# Altium project PAY_IF.PrjPcb (part 3 of 7)
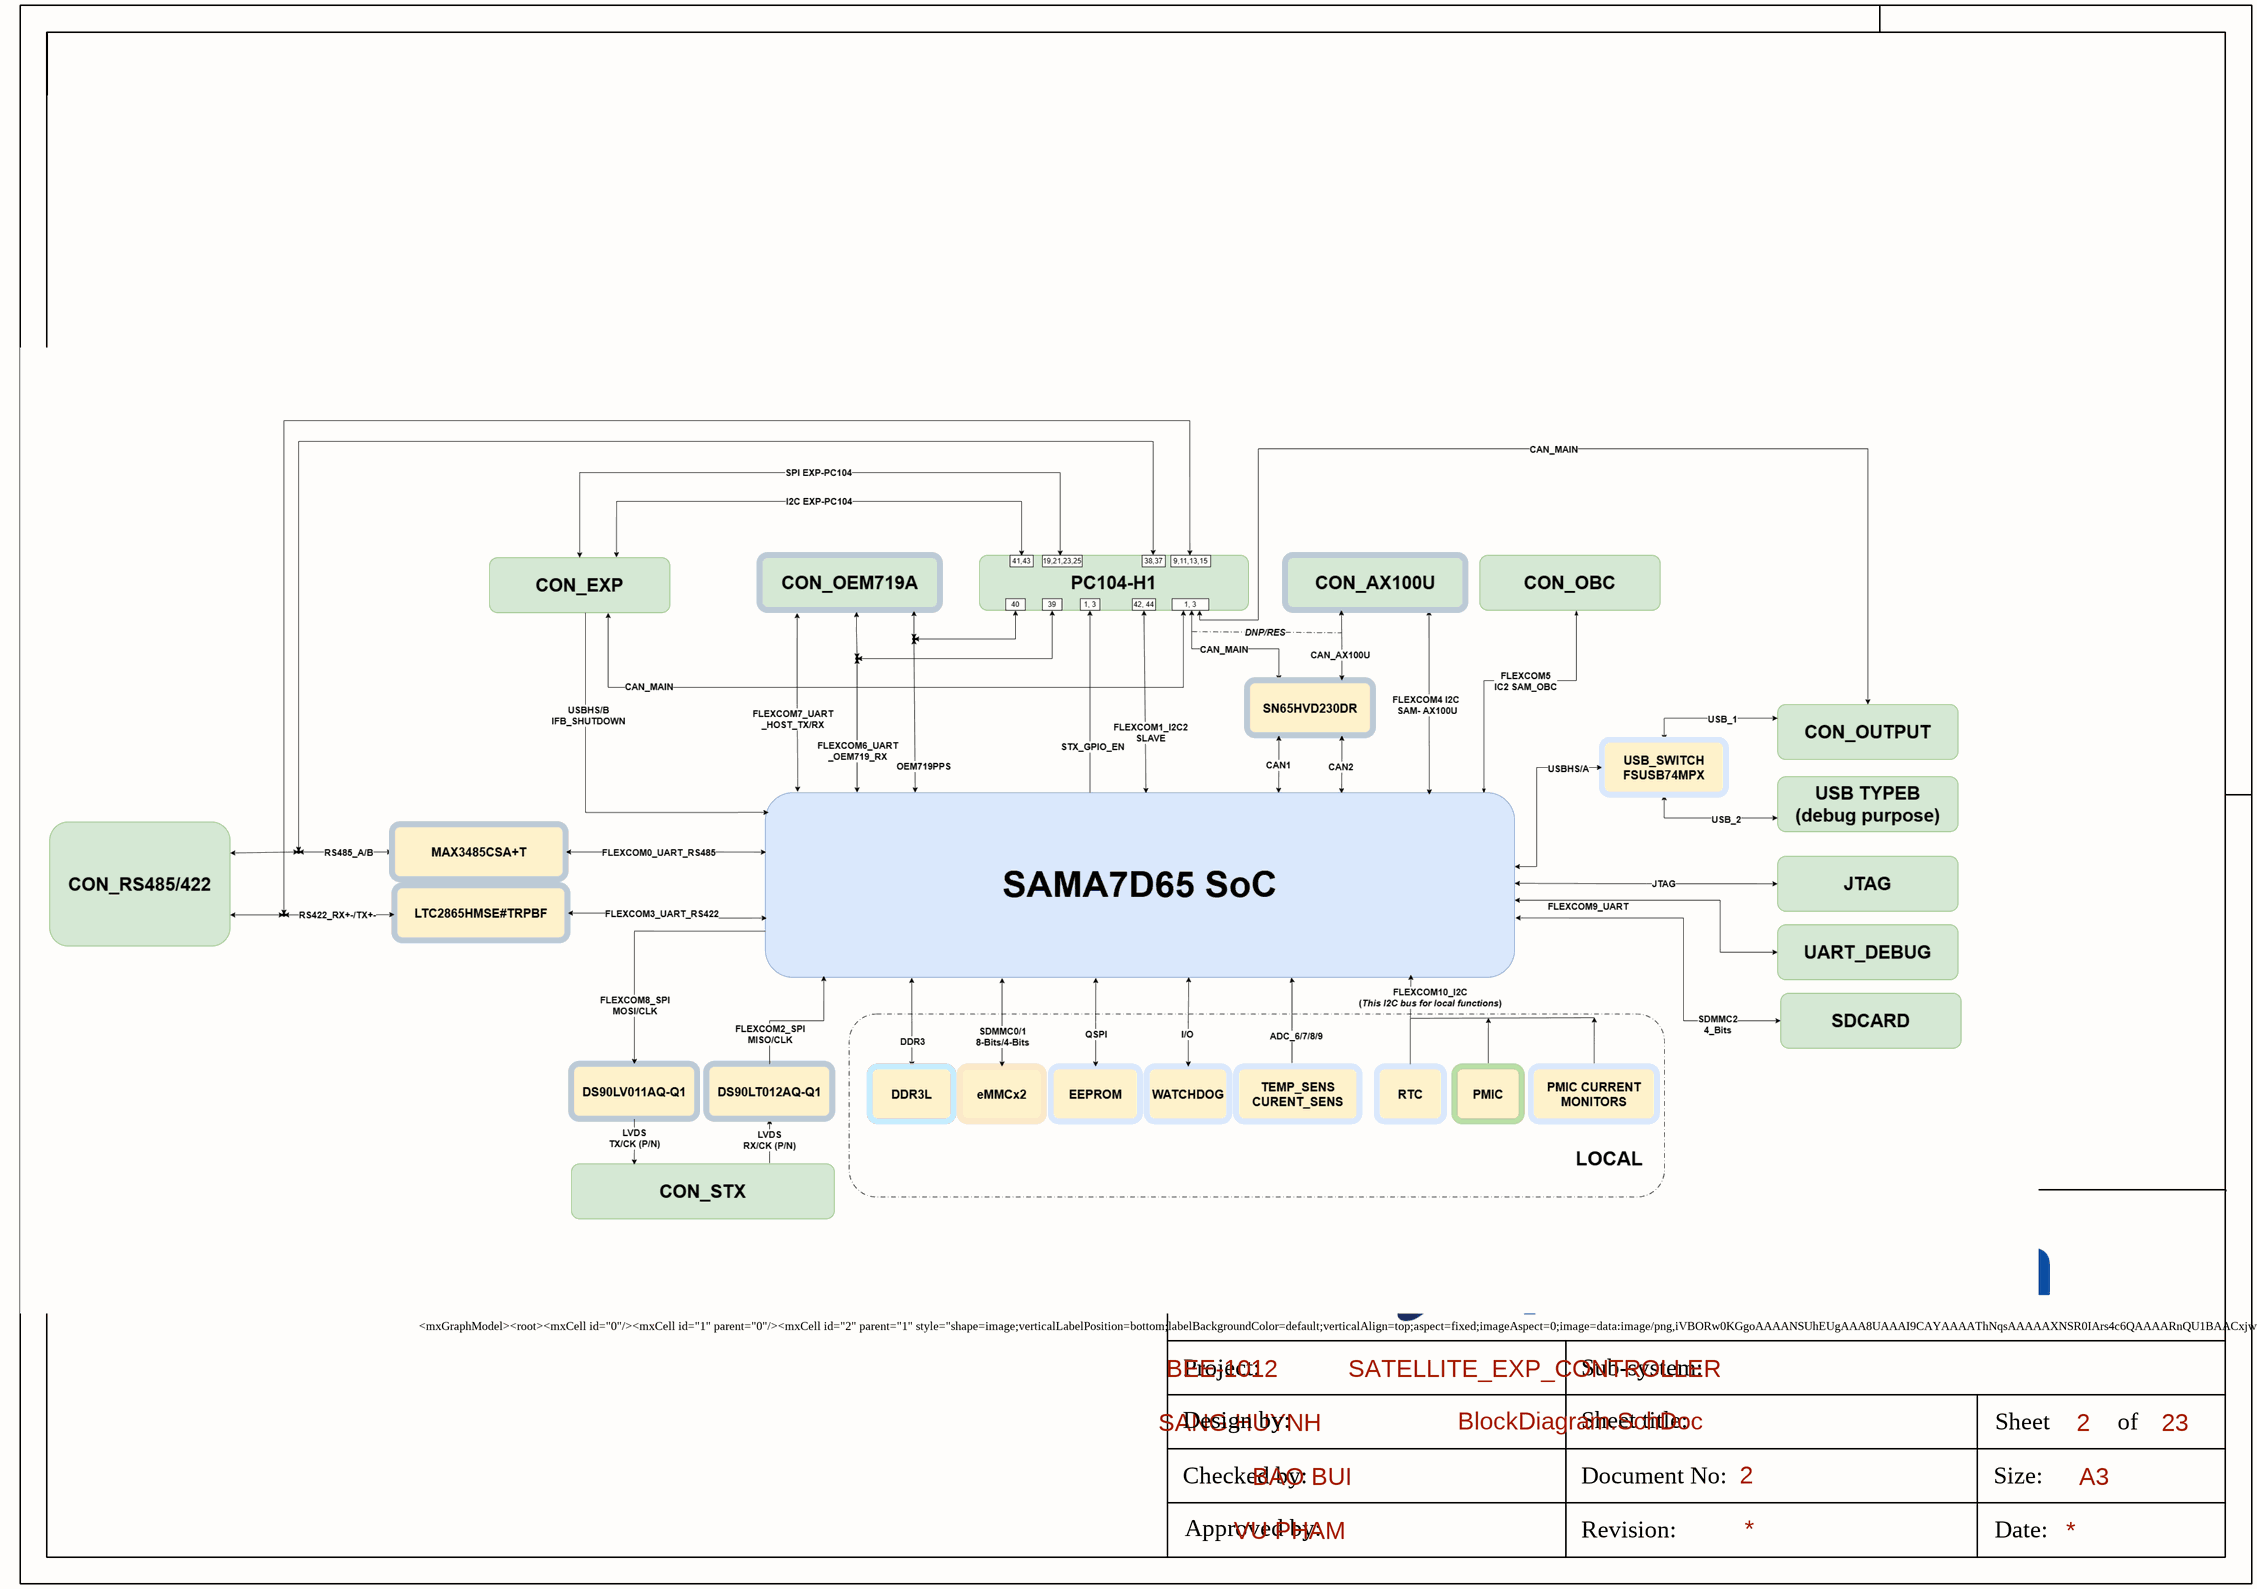
[diagram p29: BlockDiagram.SchDoc]

## Sheet BlockDiagram.SchDoc (continued)

### Notes on the sheet (continued)
JqvcTMV7Viu/XVq8e4P+ysQOpsY+cgftl/CTTGbK1QFBlSKSDqOwohJNKsQKHWWHbZzwsWz9ZQRYEslc7zK4TY5hW1xpJVG/St9bheu8T31fUY6Pg5Rfu2CP3aGnDN+aqy3LYfB0Pe8wbq2GzIe2Ubc1++foxoIiK6HAM1nyaiJixDdA2Yz69L36bTRERE5+Z7VrmQmmIiIiL6HnK8nnhEAiIionNiUExEREThOo9NTEREdNkYFBMREVGwamzirxlSioiIaGgMiomIiChQic+P3T87dWxGRER0udjRFtGJsQzRNWA+JyIiokvme1ZhTTERERERERFdLQbFREREREREdLUYFBMREREREdHVYlBMREREREREV2v0798/99fGO//995/9JyIiIiIiIqJv5d+/f/afAPY+TXR6LEN0DZjPiYiI6JL5nlXYfJqIiIiIiIiuFoNiIiIiIiIiuloMiomIiIiIiOhqMSgmIiIiIiKiq8WgmIiIiIiIiK4Wg2IiIiIiIiK6WgyKiYiIiIiI6GoxKCYiIiIiIqKrxaCYiIiIiIiIrhaDYiIiIiIiIrpaDIqJiIiIiIjoajEoJiIiIiIioqs1UFBcYhGNMBqFTdGitJbPkex/jxawf/Xrtu7RKEHesGx9u1y0bTXSalDmWCQRImsboyhCsshRhqxyr8yxSJJaWqNRhChKtunZyzjVj1mUtO5Jo3wRmdvT+RzaSpT5AklkpxshSjoes++iPLIM5El1DoPyL+rnPwrIxwf1vGNPh7xtL7qTJ/VlOk098ip9tfb8sy3nCRZ52ZiH6gLSNSZXnm9PI/i6fdbyDJT5wnmfOe5YBvoO97YoQdBh1M9X6/WlRL6ob+vX7veR+Q2oH7PWyVV2iIh+ANUiYBalVKYkoBA4ibRoXl6kyv7Vr9u6AaGM1WdS+02qTPvJJZO+/dAUmZLCXrd7ErJlnzuktU0v86fXcMxk2867FKkStbTaj2MjZ3r2JI7b1i+CkDKk73eXMqDlX29+1DmOcfjxdOcd9ySUdGyTXoaOmrocHzobhOTzTvkHuzzUdj1TR6Vbz5pd0hBKZrUEKmcqz0Uma2W5eXKXx8463I8u4t4Wcvz18+W5GIYeb08SW6fc75D9NTiOmXdylR0iou8BnmeVkdrO0Gg0GqFllt1byilWAAABKW/tGQz3T0vEY/0v2vIiRbGewfjZS19WIn2+x409i2GC2Fh5iUU0wXyz+6/MoJax9rumXCCazLGdVSJTSzjnNObbExDyFtsj84GP1cb4XaQF1jPHXucJounKkxbw8bHCxpyh5Tjq50vjXcYtT0aYbg8+hNjstsNzbHys4yZkiuenO0wAAAX+vL5gvjr8irRYw3XILk1QGdL3vct5yBOMtiegOQ9ZykWEySHD7wSv01/ePt/f8bYy86vMFPQiVeYJXt+1GQ70cmHmccP9E5bmBYQuQFA+b8k/+HzH+98PrA7lfKc1f7akW2PfB9CaxufnO97m/rx9cPLybN239oSAvK1KzcfHBzbWzcGfbotvem9rPE97+n41PQNo5wbY5ZGHe9zc7PLt2wr7bNu4zzjDfnvnc/Hn+zpX2SEi+h68zyp2lGwLmKXnW0rVc/k+y+4YNWdNb0ELlWpvdpvfBFtvXYVUaeFMUKkiU6kU2/lcCdo1ekKq5sqJQmX7tPaTK02lrGMmtTfWTfveREtHptrxOaam2Dy+TbUkhV6zf+z5PjOElKEz1SwZx/mocx9S3gqrNjg0P+hlJ3QZuhRB+Two/6htHkqtWjnv/KHp+oSkYeXtpvlOWp7NayUCahKLLD2U9eZ023y3e5vQ1tFyPWmtKQ67P21rgIXn93Psd4f8plTPZYmIvhd4nlUG+qb4mxvP8Cz3/9lg/uj4Jid/rd7KixRPjhfJAJAn2ltqkaJYLzEbN7xVHceYLdcoshTpvZ1gicWj9kZ+l1bzC9ox4uUaRSqqP61eAr6n+oWnw85v8PandYGDcvFyaB2QPt3ZP3djHd/fDW/Zx/ETDru4eUOHzSWYx1k8POHp4XAwO517vzHiZYZDkcIHPodKmq7EGPFsiXWR4nBF28zx2H5BO7Ex4id9m/6iMGc4uTzRa4gF0kJhvYy9NYPjeIblWqHIUjzc+eZs9u3ubbfP2n19hZfWBTzKP3gLuD9hHGO5XjfUEp9pv4mI6CgMineMh/jNHK9GTxI5kkOzKYH0d0PTpHKBl+qpoXk+yzieYWY/N+hBIiSywOZQ49nvKmjEBnNzR9zi+8O+b+avgZ1olPizf0oQDzjyOeug/Pw4/Fs83Hn2dYy7kwRy1yF/r/Lxw90Y47uHwwP+5u1P/WXQ0Sb4peXDv+eOHOhnGM/wWwsKwq9PJzS+0Zr1n/mFj3GPAWTW7ROScTzrNP/BN7236S8wNvPHrw0oz7jfRETUHYPigxjLrKrbWk2rHharGlEA8rnxoSJ/1d4Ce+YLUQUvgEifOnyfO8asej0OrN4DHiJjPB3uuiu8ty9g3ODlc9jN3af4W31AdXvjT80I5BhtdZDjkK32+XN8h+odw5A172PcOD8IJupmPHvWWh0EXp/O5hYtl6tBmfeYzP+d7IC+7b3NbgU2REB5ZOuAs+43ERF1xqBYpzfN3Te3Khd4rHrhQtb4FKIFHABkrclYF3pa2xq9TrSa39CaDD3QXL04mo8bSiwO1QYSvXZ1Z1JVK+IjZIP3Pj5btpUO8vfDy50qf+oPXAM9NAK1PPxr21sa0RH0l3bA6quj4vITh3Yt4teuI8BzMMtU2vQNz+C+973NaAV2bPNjo3XACtMkdKikvfPvNxERdcOg2DDG7LfZ3CrSvgGSmadHZf1BqW+gaKR1TE3EEU1Xu9QYat9XdXvjHaa19ld/QDnyrf01qmoqrPypP3ANVAthtK4YoHk9Xbex3uzgi1+E6bWmQ7SSCdb7vnCk735vM16qNPQZ0sp8MYPVFJNoO/5zkC/ZbyIi6uIEQfFf/Mlz5I1T4E3kKC3rDlm11dzqMCyCp3MtAEDx1xpiYSBH1USYTVfDal7Dawyrh8Ij3ng30GuqW9/mGw8YFET/JlDeWy8yYtxXUXG/5qlliTzRh3wK//6QqNHkV3V9aDXAfQBAUZYo9SlfIIn2Q9AB4ozNlwHrHnPUfeFI3/7eZjXBr/UZEmY8WyOTWi7crDCfTjDqEhzjvPvd3TBlh4joW7K7o7YFzFIfqsE7uYZ+6TMkQId1B6dtp+naZsuQQwUNkJY+bEh9eIim4x0yJE7TsvqQFU3L+pnD+Agl00xlRaGKolBFkaksrYYVqabj1nVOCClDJx3CRakirYb2cI7qoec55wx7dtnwTEK2lxtDSP6jS4WQfN54/WhhDGXjyhtd8mXTesPTaBsC6RTlWS/DzWW0fR8aF20ywP3oYIC0gu9t9o761t06JFOlyKyhwg6TULJpfCXfugMF73fn9NvzTN9tJyK6FPA8q5ygprjNMU2HzqxWE3ktvRy31xjqzWKHbjoYLwujl83VfIrpZILJZILJZIrpfI7VSaosfjqtp/Cm5o8DN6EWaQa1XvbqkIfoUm1WU0xGERJvk5YvULt31Z2ulvHCGcP5HT+81zheYq0KZKm0Wi9ssJpOMIqOaZ5NRERfbfigWKQolIJqnDzf5fbVtu6gIRCssQR3LmIokCO19eas04ewqHe4FRBc9TLGbDeWphR2Y0kBISTSrIBSWscpRzVFuzL6GJu1ptN75guRoDE9hUSaZciyDFmWQmpNCzfzKaKQNIi6aivzQ9wHGtIoikJrQrvBaj45Wz43vqtuMp7h96FMVlOqN/v9Qbrc2+xenPvd03fjaKv9/Ur7aTPH5MSBcbf97qAh33cqO0RE39TwQfE3Vy4eq7EEZYZMG6pomnhuofo3b307f+qdVglt2N9ufB1uacMwnaKDrb1xPMNyvbZuyGus10vM4rFZG3J7w5t0i/LPW9Ux0P3E/E5SmyZVVBw4ZvEv3MUx4jhGHM+wXK6hCr2jugl8RYYomP5d6xeW+fF4jHi5htKG7+sXXB3J05pjfCiT1XT3y56rg973I03vtHrc2wAgXqI6dYEv/1ps71eF9qywDYyN75a/er+JiKgVg2JDjldr+KVY76BjNW1+yDeGbOg5ZELvtApUw/52rdEd466Kio0Ot6rei4frYOso2gOy+Clj/RjnfEh6ngZW031zdMe070EIjhciocYzrPXxvmutDYi6M8Z4vYQybw3fV/vU5BTl+auG5el9P9L0TqvPvW1Lbw21mT/6O3UMNkY8W2sBtzV02AXsNxER+TEo1uTJ9PC9bFUTao2R2fiQbw6Z0O8b5J5paePRtjY1dDB66tzXSBi9Fz9/6bei+gPyyZqRfaUONQllW/WBnhc6OSLf7Vnf7h3T0ytRxRwn9zLKfIfegAcrz/onDv4RAobV835k6JlWz3sbsH1xp48wMeRxjLXWNubQYRew30RE5MWgeC9PDkNtABLPWtQ3nv0O6KBDr2Ht26TOSiuoKeteicUhegXEw90RTQ3r35eaTXC/8DW1Hpz/qDfm+kOTo+bJSf/G2117r79AkJnjGzF70ps/d8p3OjP/GjUmRB2ZY163DI13MU5Tno2gy9dyaVA/6d62FS+1filWL1iEvrU42mXsNxERNWNQDNRuOjKzOwML66DDqGHFCtPQzjbKvDbOoT2uojsQr8uTSfVNtBXcd2E0MXt7xGP1MfGXPpRWYySf9rvm87MCyWnizGMG7RtviAfUn6H1GrbAFwjGN+XH1/KarQ1axp0malDmiTbm9fA93h/P/MazXnt9ivJsN9sGVtPoLGXrJ93btvQWYBvMX96s349jNPO3gtfL2G8iImrCoBhW51pNQZ/VQYe7060YS/2jos0ckyhpHvC+zLFIIowmU8zf7VfVZrPtzXyCKFn404pGWm23K7jvwAiONlUg+mVvqUtz/0SK3z/s4aD+4Nmcd8pFhJF2sp3BgtbkLvwFwlC1vGZTz87NBenKlciTyPzOXWZYhmXiEyuRJ9o9o+GF0+DlGdi+oF1rtZzYYD6JkCxyT5Baovhr/62rH3Rv2zFbgFX3OJc8GWEUJcjLpo3cnsNqG101/Zex30RE5DZSSin7j7rRaISWWQDkSEa773FFiqJzt/3a8hCQ0t9Fyf3TEvFhBfq6JdLne9wYc9dN4ljbPnPdabFu/l62XCCa7Gsqm+ctF5FRu7ElIOTtrrOND3ysrJuwzKAcT3x5EmFqD84rBOSt1m3Hxwobe5a0wNq1cUDw+arvh0TWOKRWiUW0f6Ptm69JtU1CSjz8usfNDQB84v39DSvjGDQf+0sUVoZ28sR4OAas8/3xgZV1soXMsK7lHf18dDxeRj63z2VY3gHa0nHRy2LI/HRJwvJ527XecW3E9vpYLPXrtq3vfQBBaXx+vuNtvjK2T2aqOVgfrDxbjLKlMe4NH/j42HS8N/jV7wnAxd7bGtZrcJ2f2nL6tXRLCIFb7Tib9yf/Np58v53lyjTsMxQR0ffhfVZRLQJmUUplSgIKgIJIVWH/3EpbPmCS2fHLAkKl2gZmUvvNTNjJmN+zr0Umlait2z0J2ZyOUkoVaXhaEFKlmS811eF8WcfWe3wKlYr9vFL55nQLPI9CqtbduzAIKkOaIlXycCx9k1BSz8y6Iq3yjPccu+jn0lPeWtP1peOi54Fj8hB9pbB8HljOD5NQMqjAd0+3XnS6pxG0bUOUZ6dCZVI40mme2u41Ib7Nva39glO7RjUtl6WhxznsHJ50vwOmxmt60OQqO0RE3wM8zyrNv+z4Fq50eVB2cdyYPJN5Qe+2rHFBNwKH0IfwTHvAabs5FKrIUiWFqN0AhZBKppkqvMvrmtOCEErINODGuWc+OPiWqh662vf1cB5EGngsLUWmUimVsM/nbv+y8IN1URBUhmzN51sIsc079iK6TFbz+0+cU6E/BBoFrmNZ17bD9bBpynq+WKGvFJbP26/XovP1TAWla06u61lIGkKJXZBSW9yrZ3n2KlSWutPeXjuP2d42vv25nHtbGP2e7rleFoXKUunczuPO4ZD7HZJ3q2mwZygiom8GnmeVgZpPE1ETliG6BsznREREdMl8zyrsaIuIiIiIiIiuFoNiIiIiIiIiuloMiomIiIiIiOhqMSgmIiIiIiKiq8WgmIiIiIiIiK4Wg2IiIiIiIiK6WgyKiYiIiIiI6GoxKCYiIiIiIqKrxaCYiIiIiIiIrtbo379/yv6j7r///rP/RERERERERPSt/Pv3z/4TAGCklPIGxaPRCC2zEJEHyxBdA+ZzIiIiumS+ZxU2nyYiIiIiIqKrxaCYiIiIiIiIrhaDYiIiIiIiIrpaDIqJiIiIiIjoajEoJiIiIiIioqvFoJiIiIiIiIiuFoNiIiIiIiIiuloMiomIiIiIiOhqMSgmIiIiIiKiq8WgmIiI6MTKRYTRaITRKMKitH+lofA4ExHRMRgUExERnVSJP2+b3b9vcTO2fqaB8DgTEdFxGBQTERGdUvkHh1hN3iO2fqaB8DgTEf3/9u5fyU2dDQP448v4Tu3dIpMrkK/AmyZV2u2gtJt0KdOlwaXdpd1qmwNXYF/BToqFOucy9BX+gwSSECAwXj+/GWaStZHFiyRLWAjqKNCguMBmMTtNWWreFrU5TRni8+uLDaqvurX77NksRmbZt54vEyWvWloWRYZNvMCiksfFYoF4k6Hw+cizIsMmjmtpzWYLLBbxMb3qPkb1mC3ixiOxyi7T1U5b63PoUmAT95gOd46/IV6brG1iQ2pRByzlYLFYIM4K9742IcspkVW97alulzJX3fUki+v7tNqa2roB6kLx7wvKsVp1qNYUk7K9cn90PZ1x2vUWbZeKcQZuNM69dM1P0fH4s7j8DGMHon4+q1tTmxRWPT/jlC8DS1+jd59zEfv15dRzbo2BvVwM+l0xVGwMW/vyVyDb1PPWWMcIkA083iKlTGUESHhuIsnt+4tEVl91a/fZgJDax6eR8lokU+UlkzRyHYciT2Ukqp9t3kTUcMwt0jqml7rTs8Qsajp4kzyRopZWcxx95GlUSbty7pxymUaidoy1rXV5aw9t65AtT77lQEQyNSZg4JumTzmlu4a25bxxEzIyVHi1De609a1fretCU91uFxNDSE7M6QzfrjcdXwXjXLrJOHfUNz9qrHyO/0zp45n7bObzad7MbVJY5vwMX74ULc4VuvY5fc6hmn9rAOz1YpDvijFiY92ay1+932zerOG8A3D0VWby+Aar2WyGhrecrtQ8YQcAEIiiz9U3aL5+32Kp3euj7C8S5PsV/G8FUveNkPz4isfqWzQPWGofXmCzeMD6cnk5hdxWrzCfFBssHtanK9ERUrk1T8/S3ncmIKLPOEbmDW+7g/a6SHLsV4ajzmIsnnaOtIC3tx0O+hsa4qieL4VzH7MsnuHpGHwIcTjlwxEbLwWy+BlPu9pBIcn3MIWpqswXTvH6hh9fHwG84/31BWs1bdc5D6B1HbKcB/2YACEifP4MY3mypaEJWU7p7rUv5/X2+v31FS87vb2LUgm1ehZZjF+vyhsu1PKqt5Gar9+x1b+Ahq0LWYzZqeKa93HF5NhevWifbWsHr9WuN7ddF4yz5ibj3EWI/KhpNB2/qle58GuTwrpW+ToZsc/ZGEf1nFv7afZ6Efy7YujY9C1/SlkHTul9+4rHRwDvr3h92eHc9TXXhfvg7KtUR8lVHm9xXqnx02f/PvueaFfTbFeIc5koV4fsV1kqV31EJJPcmKCUeSqT86+ZpgSrV/mcvwAafhk1pSllJWaRctXLduw2SjpRosTH40qkTZ7oV+FEIpPL1T7P/FV//TftU4mtNVQBIFAdSiNxKgOmV+vn331MAcspUcByfizLStn0bk/UMu27jxy8LpTHYmu//GKifv+Y33etdt0n/5JxrrnNOLcXKD9j/FJsTbdrm9TFtcpXvV80TJ9TKJ/hyIus5Mcrbdv5q1LLZEMezkaJjS3/PuVPb7vMZf1YxyIh7K/fATj6KvZXTlw7l3xOqkuf/fvsW9IKnCkddaBlev2kMR2DPE1kUivhPl/OdXmiVkRbI1qJWeOXhln5WUImuZpfU4X1oTZU5TSR5s6OyvfiRSVWrjf2hFHqkKwdu+uYwpVToqOw5VxvC5rrvezW0Rm8Lvgcr897pEdMrtWu++WfcdbdZpzbC5afqw6KpUe5COVa5WukPmeUtrgNUTnn1v6M7/lTtf2uGCk2znQbyl/X+nGH4OirBFpo6/Yttymi838Oa/zS7q/PEF+mJAgkvy3TIIoNfl5mLjjeVzFfrrCqToXIfpVTuhEhtU690M1Xv5GI8/8OWOsHYrb8ejn2w/pX8+JhAKA++kJ8wxefzPkSEdJ8j22XqR3q6qMiwfdqXBXzL99wCdXu1fO4p2yOL98uRwS8vZsXZghZTokG8YBPSjv2J9dfDWboupC9XqYMim9fvNK2W+Jr+SWFl3+Ntbs0pXadca640Ti3NbX89DJSm1Q1Vvkasc+5/J5c+l6H9bPfolvXNGJs7K5U/u4MB8UXS2zTyzchdk/lytLF5md5L0T0w3CP0VH2S7lnxvE+H9lreV+ASL7b7/+omWP1ozwOv8HeEt8vNXeH1+YdtEYi+uHXQDRb4nuaI99X7zlvIf9TnoPPj+58zb+gHEO+4X3qDXNbluMPWU6JhjHHo/Emr7CGrgtlOx7hR4DEH8pekYeptOuMc82NxrmtqeWnn3HapLpxyteofc75CuUufQeLwxs1NlYtyt/hDzhm7oaDYtXyu3JVZ4efmwIoNnguV+FCary7HQAyKPXG8DiINtS0BL55XeZTKFcWfQd76q+mu59NS/YX2Fwu/0bodagV8+XcqwG3Kd7fLv8Wnx601+rURuZjXHnL/1y6IBYhyynRUPQ2sLEqdzJwXVB/JYvCPDO3uX7rptGuM866G41za1PLT19jtElmw5ev8fuc2uzM3c8J/1o8fmzMGsrf/FFZLGyHp7jNI5zojINizRyr3/q0jsVzeaUzSh0r9hXvKIdjvg2RhZbWZzy2rIOdplmov5oeXuCcMaZMUW531Wx4amfmc8vAvXVvrSbCoxMSspwSDUSbneM7/a+tgeuC+5m5XRRQrvn5tW9TaNcZZ92Nxrm1qeWnp1HaJJuhy9c1+pzaL+AHrJ+bBvtXcpXY1DWXPzWeAHZPeDg9d538DTAo/oN/swyZdRvyBDV8ts9HV6Z1XJZWb7g/VZu2G5L4hOoFoWb6NAu/wZ46zcM9naWcEtXhqtnEtJsmN3HKfXXWTshQ5ZQohKJAFi/wcJmd438fYmuD1gXlnj5bXWxLXS/BO80JtOuMs+Y249zB1PLT1ZhtktWI5Wu0PicwX/1wrOUzQSPG5qJF+Zuv9kgjpU972GH99IAZB8fewg+KDzusn57wZN0GvKm+6bM9r0Rp0zoAZyE06lRxFNf6MlGneVjvfVB+jTRerbom9Qq/YXrJh6YuBud5hbhvOSXq47DGw2yGmbo9PJTPJxeR5TmxAwhdF9SBVYgpvUWGWH3Oa5s0p9SuM863Gee+ppYfmym1SVVDlq9r9Tmra/k0Tg2/gjFjE6D8Lbd75GlULiILZXA8WyDm4Ngp/KC4UZfpByPTpksAXitQfgjqqpvmBR3UKRy+CzjQ8LL49PB3ABAJfrtaTaKJE0kKud86v/ynrPuU3upspw3ieIHZg16/c+vaFiYft11nnGks12+TPmj5UtfyOazxPNivZretTfmbL7fYyxxpUhkc44Dd0wNmiwlefJiI8INikSA/Pv/Ysjnuy+2r6bO9llEvsFHuIz7zXwp/erzuiTpRl8qvX7UbYKpaUB9v4SwfxWaB8kdi/8cFEF2ViJCkKdI0RZomiJRpX4f1ExY32znK8Os81a3ptpuq2mynNXbnXwkAiChB3qF+33a7bsM4U2ATb5NupXy16XNWV2i+5b62D2dsgpa/OZarLfZSIk8TqLOqcVjjgQNjo/CD4htXbJ7L55FFKVJlKfyn2FFVHz6VV2T6LofeOy19oZBWXAs6KMv8e03PvTHOxmqqsli/1yRvuOjUu2wRhfIJX5ZLLJdLLJcrbLd7yFxd6PABria3t6HqQtBn5gIQAiJKkOYS+237gRpw5XadcT661Th3NbX8eLlym9RkqPLV+1z16HMCwHKLchb16ckvUzFqbIYpf/PlCtt9roxncBv3cF8BB8Ua5crz6fFLS3UhgN2TvUBqy6H3WXY9RFo5ykWY214xnONL2epqCzqUz2rruIDDCNSFs3wWNGj76I1JyWLMLj8Ri8Z7TYAQZYtoQPMV9mPdYzZQXejVTppmO+332G9X3Z/dDly3XWecgb759TFQnDsLnR8tvRGN2SY1Gqh89T5XffqcR+qv4If1gGsPtXXt2AQrf3MsV3vl4gOwM83Bv3McFCvU+zLLK236Muf2Aqkvu97vHuSeaamrEHdY4EJbEfC8oIP2LMgfzYOvCTg0zp++4YW5shgLZUAcpR4DYqB/2SIaWuUes+GuZg9RFzoudDOC67XrjPPtxrmPAfPT4he7wv9nOrvR2qRmw5SvnueqZ58TOA7+1Ce/uFbYHtcEYhOw/C3LG9OBt3fLeOZ+cVB8lsXafZk/lFZlvvrtsRCAegWv730RlbRe/m1RcNUHt3edVqYv6PBzU/RY0GRc6kPuGyu8unLpxDpWTsUGi6fd5bELUbqH/3owIcsp0RD0Mjrc1ewB6kLoKb1BXatdZ5xvNs69hM6POjgxLzRVp95n2+EX1Iux2iQfQ5Sva/c5j7Qnv+x+YuN75WNQU4jNlMrfx8ZBMVAruFFavS/TbyEA7QoednjyvZG9yGrPEKs+v808EK/L4ofynujK4L4NbSrLyzOeuy5oMjZ1qkvDFTX1i6R7YzWyYoOF8siQdgPio5DllGgI+q8hPwebShe6LpRTGLu3vUO6VrvOON9mnPsKm5/KwOApNvbDNMp9tn0vfI/VJvkYonxdu895pM7MPGD986Xy+nVMITahyl/Zdt5Qv3dEHBSjsriWrVGpLARgXnRLf+bacYW3GLW2/azIsDk9BmL9Wr0kpk/bPqwfsIg37rQWM+XXbtPgvgVtQYfDDQ0eK9PdLV+chbZAVb/GajS1AXHeekB8FLKcEg1B/TWkw5Q1bwHrgjaFscXzbcd0tXadccatxTmIsPmpD7LtaRWbhbLmRohHFI3VJnkYpHxduc95os/MLI/tuqYQG3f5y+IZZosYWWHLVPVJJX1mTnxgsoHHW6SUqYwACUBCJDKvvtxI2R9CRlHk3FLtA9TPjmSSpjJt2PT86Z+duDKfJ1J4vDdPxOk96iakuByDUNI5bVFaTUZKKWUaGdISeoyEqH4WpLBlTkrv81U/jkiacymllLlMLvlwvc8tN5yvMl0ho6TyujHz6jk97iei5LRPIiOhH5cl9MEgSB1S41svA7YtMQdISuP5PceqfTklClPOFVp769OmqPXe5/2lEHVBTaNdNWkREye/dOrH6oqVT7vu97nS+NmM89H04hxS0PykUT0t9fuw8v0OQApbWlK2imv7NqkLv/zUY+rKj0/5Ohq8z+k8Fyemc2zdzy9eum7fFYPHpin/1vJX6R8CUmj5qufbnaePDY6+iv2VE9fOpRYn1UgtoM2bXjfa7VsdzKaR8pq10pW09zuONU+jeiNv2URkT0dKKfPEP63jhQFXarLF+arE1hkf/0bXru25dOQ/T2VkaJz0TcioMVb9IUgd6hAba1qlkOWU7huClHOV/kXvbH6k7NzROetXF/q0f21i4uKbTuh23fdzjxhnE5/j8v3co35xDi9ofvLE4/sdpwvpzpRaxrVtm9SFb35Cl6/SoH1OZz7P6oM8+36+8VJ1/64YNDaN+beXv7R2kcS2+dSJjw2OvspEpk+rCyi01WNfdRqWOD6Cqclym5YPwa4+J04xX26xl/npodmiXPzpRIgIUZIi93gm4nzlTuv8fMUkzSH3W6zaPFPi82P1L4olvl4OViAxzis3EJ+qf/HU41xWzZfY7nPkaQQhKokKcYr9Hts2sbqyTrH5/OguWwHLKVFY+loOPouLdKojJ73qgrpo3xSm9E6qXdcxzg2mEOcBBM3P/PjcVXtap+94ucc26K1R7dukXq5Uvgbtc3qZY7VX+toARODHg3T9rrhubOzlb7naQ+Y50iQy5mu4OvGxzORx1Gw1m83Q8BYicmAdontwz+W82CwuaxREqex4rz81YZyJiKgPV19lIr8UExER3aIMvwKs/kpNGGciIhoOB8VERERdTfqZuR8I40xERAPioJiIiKij8rmPfMTFkBhnIiIaEgfFREREnRR4fzv9U3wDx2pDYZzHkSGezTDruS02lhVIPyTGjOij4KCYiIiokzlWewkpJeS+YcVc6oFxJiKiYXH1aaKBsQ7RPWA5JyIioilz9VX4SzERERERERHdLQ6KiYiIiIiI6G5xUExERERERER3a/b371/zxOqTf/75p/onIiIiIiIiopvy9+/f6p8An4W2/vvvP/zvf/+r/pmIPLEO0T1gOSciIqIpc/VVOH2aiIiIiIiI7hYHxURERERERHS3OCgmIiIiIiKiu8VBMREREREREd0tDoqJiIiIiIjobnFQTERERERERHeLg2IiIiIiIiK6WxwUExERERER0d3ioJiIiIiIiIju1v8BdRxHBGg25tMAAAAASUVORK5CYII=;" value="" vertex="1"><mxGeometry height="614" width="1034.06" x="738" y="1685" as="geometry"/></mxCell></root></mxGraphModel>

## Sheet Power.SchDoc
size A3; SheetNumber: 3; SheetTotal: 23
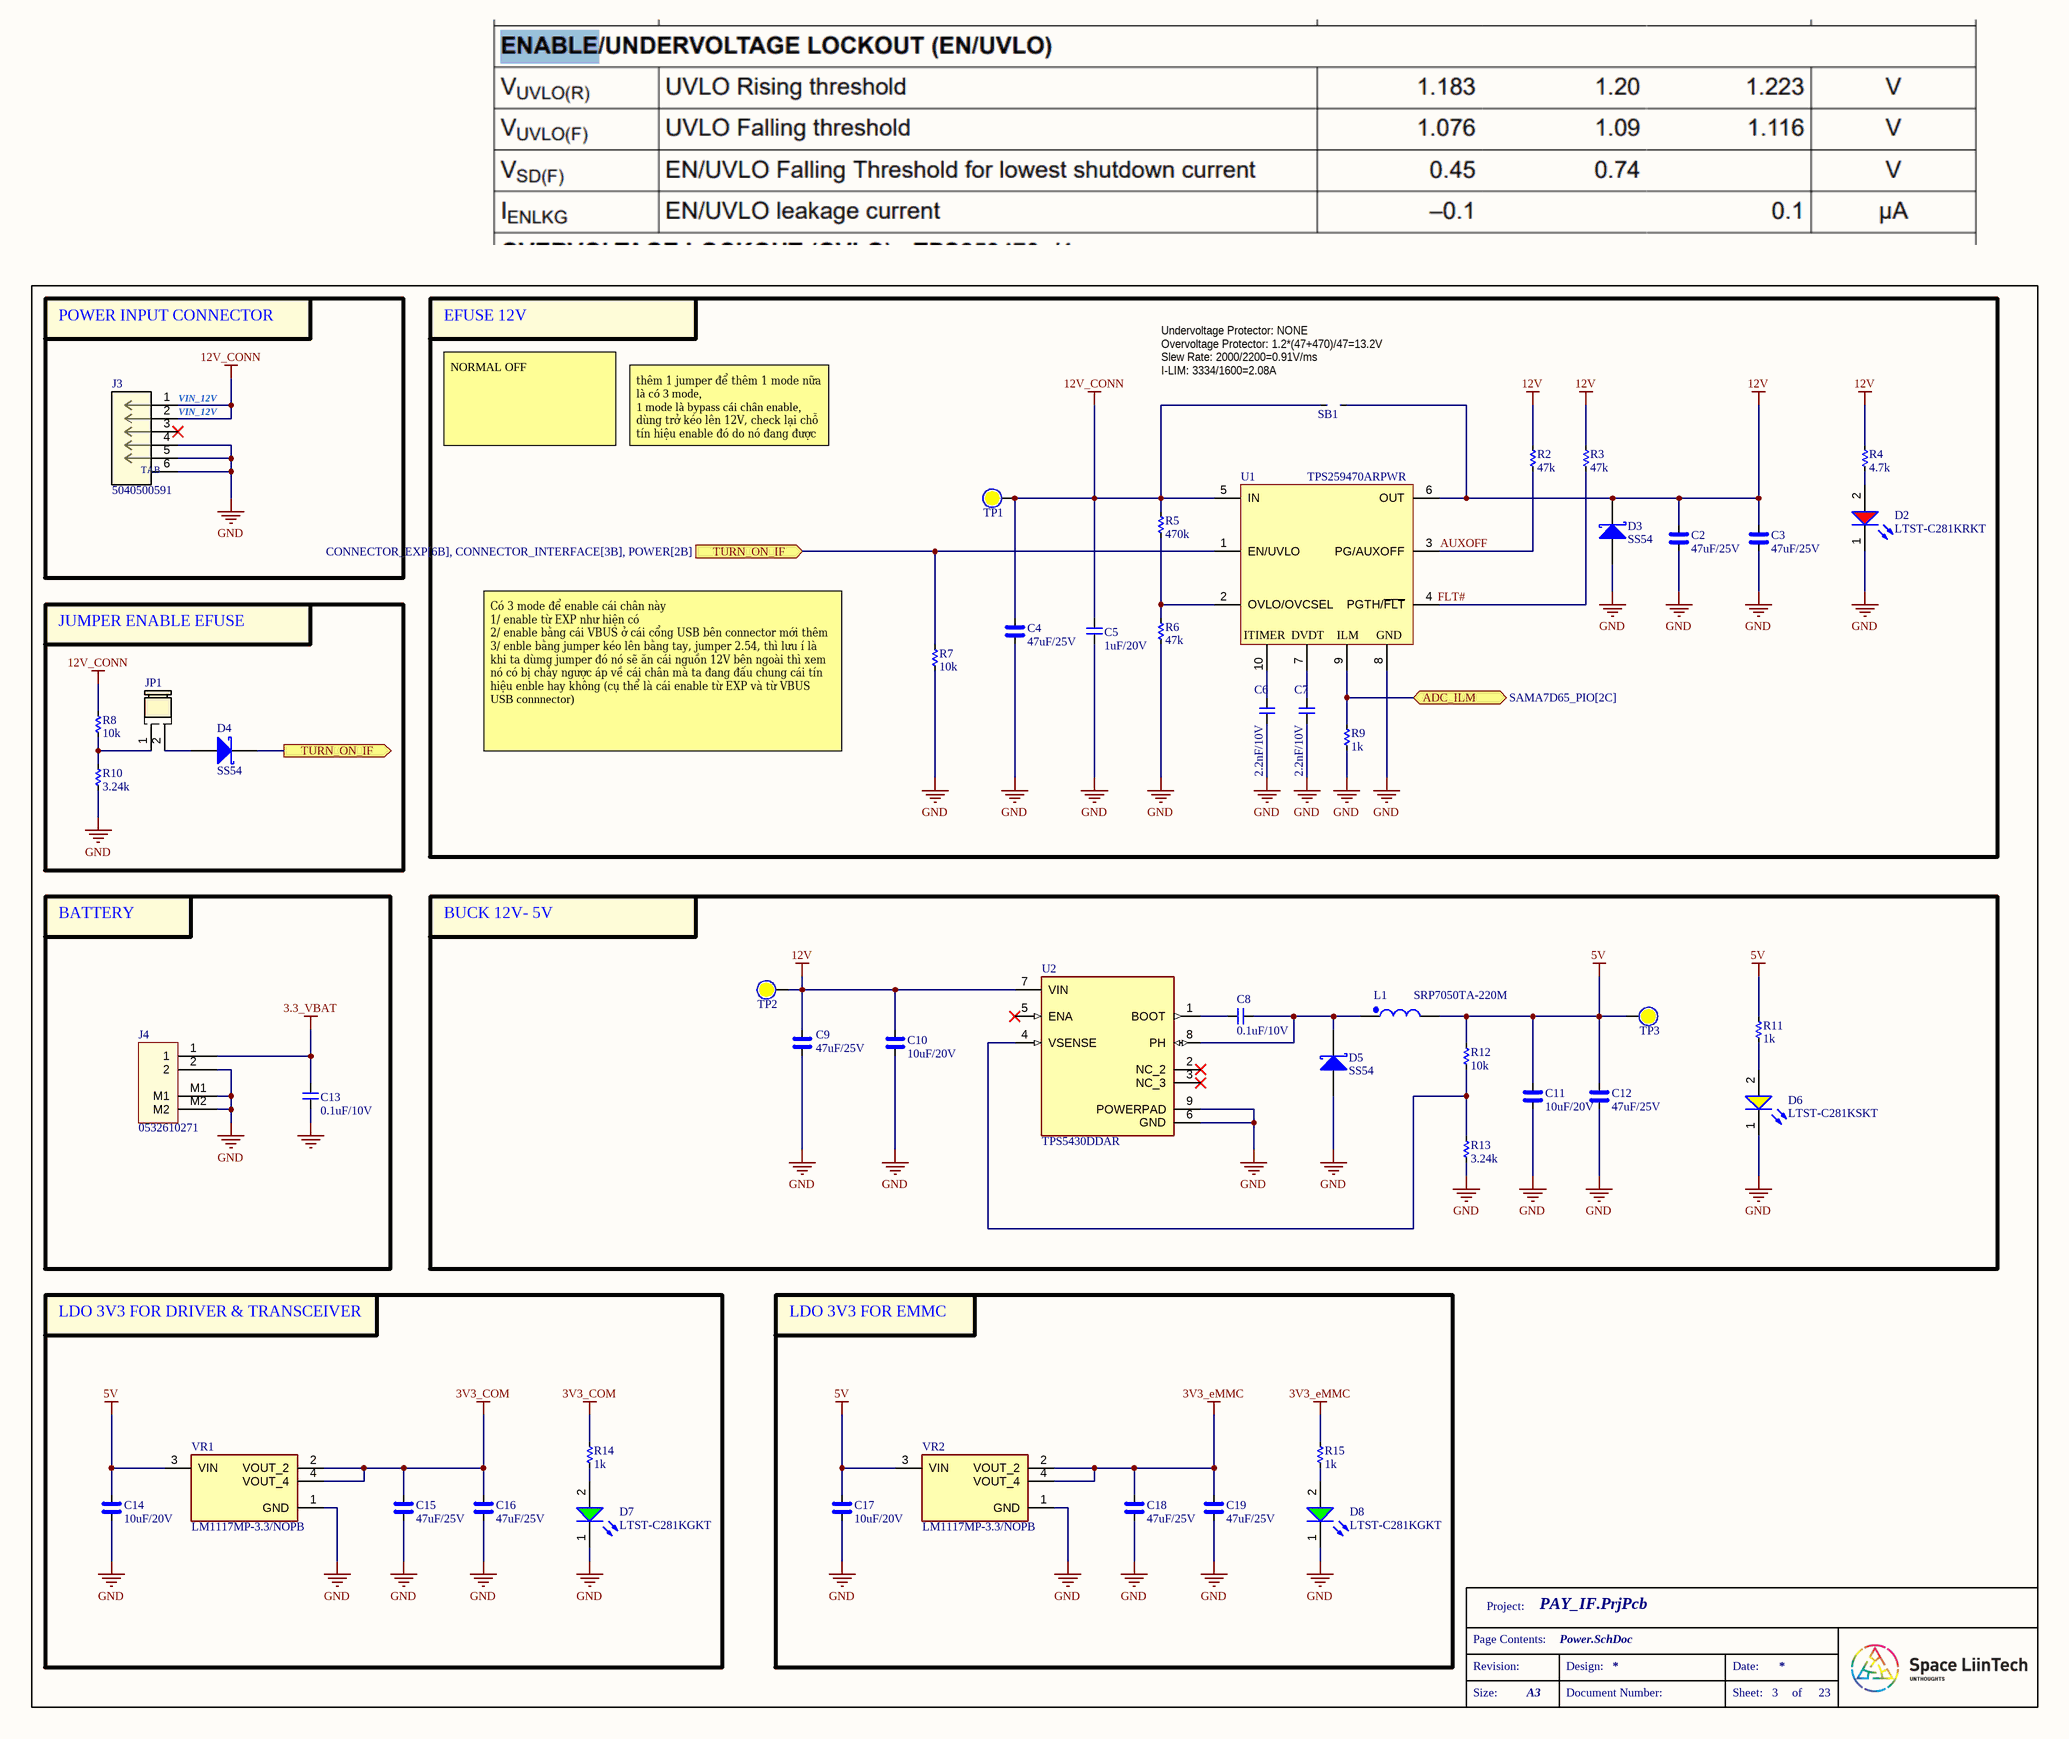
[diagram p2: Power.SchDoc]

### Parts
(Parts that share a designator on the sheet are numbered #1, #2 ... from top to bottom, then left to right.)
C2  47uF/25V  [CAP_C_3225X80]
C3  47uF/25V  [CAP_C_3225X80]
C4  47uF/25V  [CAP_C_3225X80]
C5  1uF/20V  [CAP_C_1005X50_L]
C6  2.2nF/10V  [CAP_C_1005X50_L]
C7  2.2nF/10V  [CAP_C_1005X50_L]
C8  0.1uF/10V  [CAP_C_1005X50_L]
C9  47uF/25V  [CAP_C_3225X80]
C10  10uF/20V  [CAP_C_2012X110]
C11  10uF/20V  [CAP_C_2012X110]
C12  47uF/25V  [CAP_C_3225X80]
C13  0.1uF/10V  [CAP_C_1005X50_L]
C14  10uF/20V  [CAP_C_2012X110]
C15  47uF/25V  [CAP_C_3225X80]
C16#1  47uF/25V  [CAP_C_3225X80]
C17#1  10uF/20V  [CAP_C_2012X110]
C18  47uF/25V  [CAP_C_3225X80]
C19  47uF/25V  [CAP_C_3225X80]
D2  LTST-C281KRKT  [LED_0402]
D3  SS54  [DO-214AC_SMA]
D4  SS54  [DO-214AC_SMA]
D5  SS54  [DO-214AC_SMA]
D6#1  LTST-C281KSKT  [LED_0402]
D7  LTST-C281KGKT  [LED_0402]
D8  LTST-C281KGKT  [LED_0402]
J3  5040500591  [5040500591]
J4  0532610271  [MOLEX_0532610271]
JP1  JUMPER_254P_NOPLACE  [JUMPER_254P_2X1_NOPLACE]  (value not drawn)
L1  SRP7050TA-220M  [SRP7050TA-220M]
R2  47k  [RES_C_1005x30_L]
R3  47k  [RES_C_1005x30_L]
R4  4.7k  [RES_C_1005x30_L]
R5  470k  [RES_C_1005x30_L]
R6  47k  [RES_C_1005x30_L]
R7  10k  [RES_C_1005x30_L]
R8  10k  [RES_C_1005x30_L]
R9  1k  [RES_C_1005x30_L]
R10  3.24k  [RES_C_1005x30_L]
R11  1k  [RES_C_1005x30_L]
R12  10k  [RES_C_1005x30_L]
R13  3.24k  [RES_C_1005x30_L]
R14#1  1k  [RES_C_1005x30_L]
R15#1  1k  [RES_C_1005x30_L]
SB1  JUMPER  [JUMPER_1608]  (value not drawn)
TP1  (no value)  [Test point]  (no BOM)
TP2  (no value)  [Test point]  (no BOM)
TP3  (no value)  [Test point]  (no BOM)
U1  TPS259470ARPWR  [VQFN-HR-10]
U2  TPS5430DDAR  [CONV_TPS5430DDAR]
VR1  LM1117MP-3.3/NOPB  [VREG_LM1117MP-3.3/NOPB]
VR2  LM1117MP-3.3/NOPB  [VREG_LM1117MP-3.3/NOPB]

### Blocks framed on the sheet
POWER INPUT CONNECTOR: J3
EFUSE 12V: C2-C7 D2 D3 R2-R7 R9 SB1 TP1 U1
JUMPER ENABLE EFUSE: D4 JP1 R8 R10
BATTERY: C13 J4
BUCK 12V- 5V: C8-C12 D5 D6#1 L1 R11-R13 TP2 TP3 U2
LDO 3V3 FOR DRIVER & TRANSCEIVER: C14 C15 C16#1 D7 R14#1 VR1
LDO 3V3 FOR EMMC: C17#1 C18 C19 D8 R15#1 VR2

### Ports
ADC_ILM (bidir, see SAMA7D65_PIO[2C]), TURN_ON_IF (in, see CONNECTOR_EXP[6B], CONNECTOR_INTERFACE[3B], POWER[2B]), TURN_ON_IF (out, see CONNECTOR_EXP[6B], CONNECTOR_INTERFACE[3B], POWER[3A])

### Nets
3.3_VBAT: C13.1 J4.1
3V3_COM: C15.2 C16#1.2 R14#1.2 VR1.2(VOUT_2) VR1.4(VOUT_4)
3V3_eMMC: C18.2 C19.2 R15#1.2 VR2.2(VOUT_2) VR2.4(VOUT_4)
5V: C11.2 C12.2 C14.2 C17#1.2 L1.2 R11.2 R12.1 TP3.0 VR1.3(VIN) VR2.3(VIN)
12V: C2.2 C3.2 C9.2 C10.2 D3.1(K) R2.2 R3.2 R4.2 SB1.2 TP2.0 U1.6(OUT) U2.7(VIN)
12V_CONN: C4.2 C5.2 J3.1 J3.2 R5.1 R8.2 SB1.1 TP1.0 U1.5(IN)
GND: C2.1 C3.1 C4.1 C5.1 C6.1 C7.1 C9.1 C10.1 C11.1 C12.1 C13.2 C14.1 C15.1 C16#1.1 C17#1.1 C18.1 C19.1 D2.1(K) D3.2(A) D5.2(A) D6#1.1(K) D7.1(K) D8.1(K) J3.4 J3.5 J3.6 J4.2 J4.M1 J4.M2 R6.2 R7.2 R9.2 R10.2 R13.2 U1.8(GND) U2.6(GND) U2.9(POWERPAD) VR1.1(GND) VR2.1(GND)
AUXOFF: R2.1 U1.3(PG/AUXOFF)
FLT#: R3.1 U1.4(PGTH/~{FLT})
NetC6_2: C6.2 U1.10(ITIMER)
NetC7_2: C7.2 U1.7(DVDT)
NetC8_1: C8.1 D5.1(K) L1.1 U2.8(PH)
NetC8_2: C8.2 U2.1(BOOT)
NetD2_2: D2.2(A) R4.1
NetD4_1: D4.1(A) JP1.2
NetD4_2: D4.2(K) R7.1 U1.1(EN/UVLO) ; port TURN_ON_IF
NetD6#1_2: D6#1.2(A) R11.1
NetD7_2: D7.2(A) R14#1.1
NetD8_2: D8.2(A) R15#1.1
NetJP1_1: JP1.1 R8.1 R10.1
NetR5_2: R5.2 R6.1 U1.2(OVLO/OVCSEL)
NetR9_1: R9.1 U1.9(ILM) ; port ADC_ILM
NetR12_2: R12.2 R13.1 U2.4(VSENSE)

Not connected (* = marked no-connect by the designer): J3 3*; U2 2(NC_2)* 3(NC_3)* 5(ENA)*

### Notes on the sheet
- Undervoltage Protector: NONE
- Overvoltage Protector: 1.2*(47+470)/47=13.2V
- (near SB1) Slew Rate: 2000/2200=0.91V/ms
- (near J3) VIN_12V
- (near SB1) I-LIM: 3334/1600=2.08A
- NORMAL OFF
- thêm 1 jumper để thêm 1 mode nữa là có 3 mode,
  1 mode là bypass cái chân enable, dùng trở kéo lên 12V, check lại chỗ tín hiệu enable đó do nó đang được enable bởi EXP và cái VBUS bên connector
- Có 3 mode để enable cái chân này
  1/ enable từ EXP như hiện có
  2/ enable bằng cái VBUS ở cái cổng USB bên connector mới thêm
  3/ enble bằng jumper kéo lên bằng tay, jumper 2.54, thì lưu í là khi ta dùmg jumper đó nó sẽ ăn cái nguồn 12V bên ngoài thì xem nó có bị chảy ngược áp về cái chân mà ta đang đấu chung cái tín hiệu enble hay không (cụ thể là cái enable từ EXP và từ VBUS USB connnector)
- Project:
- Page Contents:
- Revision:
- Design:
- Date:
- Size:
- A3
- Document Number:
- Sheet:
- of
- (in symbol 5040500591) TAB

### Library data of the parts
C2-C4 C9-C12 C14 C15 C16#1 C17#1 C18 C19 = _CAP_C_High_2: CAP CHIP High Value
C5-C8 C13 = _CAP_C_2: CAP CHIP
D2 = LED_RED: LED RED CLEAR 0402 SMD
D3-D5 = SS54: DIODE SCHOTTKY 40V 5A SMA; MPN: SS34; Solder: SMT; Value: SS34; MFR: *
D6#1 = LED_YELLOW: LED YELLOW CLEAR 0402 SMD
D7 D8 = LED_GREEN: LED GREEN CLEAR 0402 SMD
J3 = 5040500591: 1.50mm Pitch, Pico-Lock PCB Header, Single Row, Right-Angle, Surface Mount, Gold (Au) Plating, Positive Lock, 5 Circuits, Tape and Reel; Manufacturer_Name: Molex Connector Corporation; Copyright: Copyright (C) 2025 Ultra Librarian. All rights reserved.; Manufacturer_Part_Number: 5040500591; RefDes: RefDes; Type: Type
J4 = Header 2x1_2M
L1 = _IND: FIXED IND 22UH 2.5A 170 MOHM SMD
R2-R13 R14#1 R15#1 = _RES_B_2: RES
TP1-TP3 = Test Point: Solder: NF
U2 = TPS5430DDAR: 5.5V to 36V Input, 3A, 500kHz Step-Down Converter; MF: Texas Instruments; Package: HSOIC-8 Texas Instruments; Check_prices: https://www.snapeda.com/parts/TPS5430DDAR/Texas+Instruments/view-part/?ref=eda; Value: *; Purchase-URL: https://pricing.snapeda.com/search/part/TPS5430DDAR/?ref=eda; Availability: In Stock; SnapEDA_Link: https://www.snapeda.com/parts/TPS5430DDAR/Texas+Instruments/view-part/?ref=snap; MP: TPS5430DDAR; Price: None
VR1 VR2 = LM1117MP-3.3/NOPB: 800-mA 15-V linear voltage regulator; MF: Texas Instruments; SnapEDA_Link: https://www.snapeda.com/parts/LM1117MP-3.3/NOPB/Texas+Instruments/view-part/?ref=snap; Package: SOT-223-4 Texas Instruments; Value: *; MP: LM1117MP-3.3/NOPB; Check_prices: https://www.snapeda.com/parts/LM1117MP-3.3/NOPB/Texas+Instruments/view-part/?ref=eda

## Sheet CONNECTOR_EXP.SchDoc
size A3; SheetNumber: 4; SheetTotal: 23
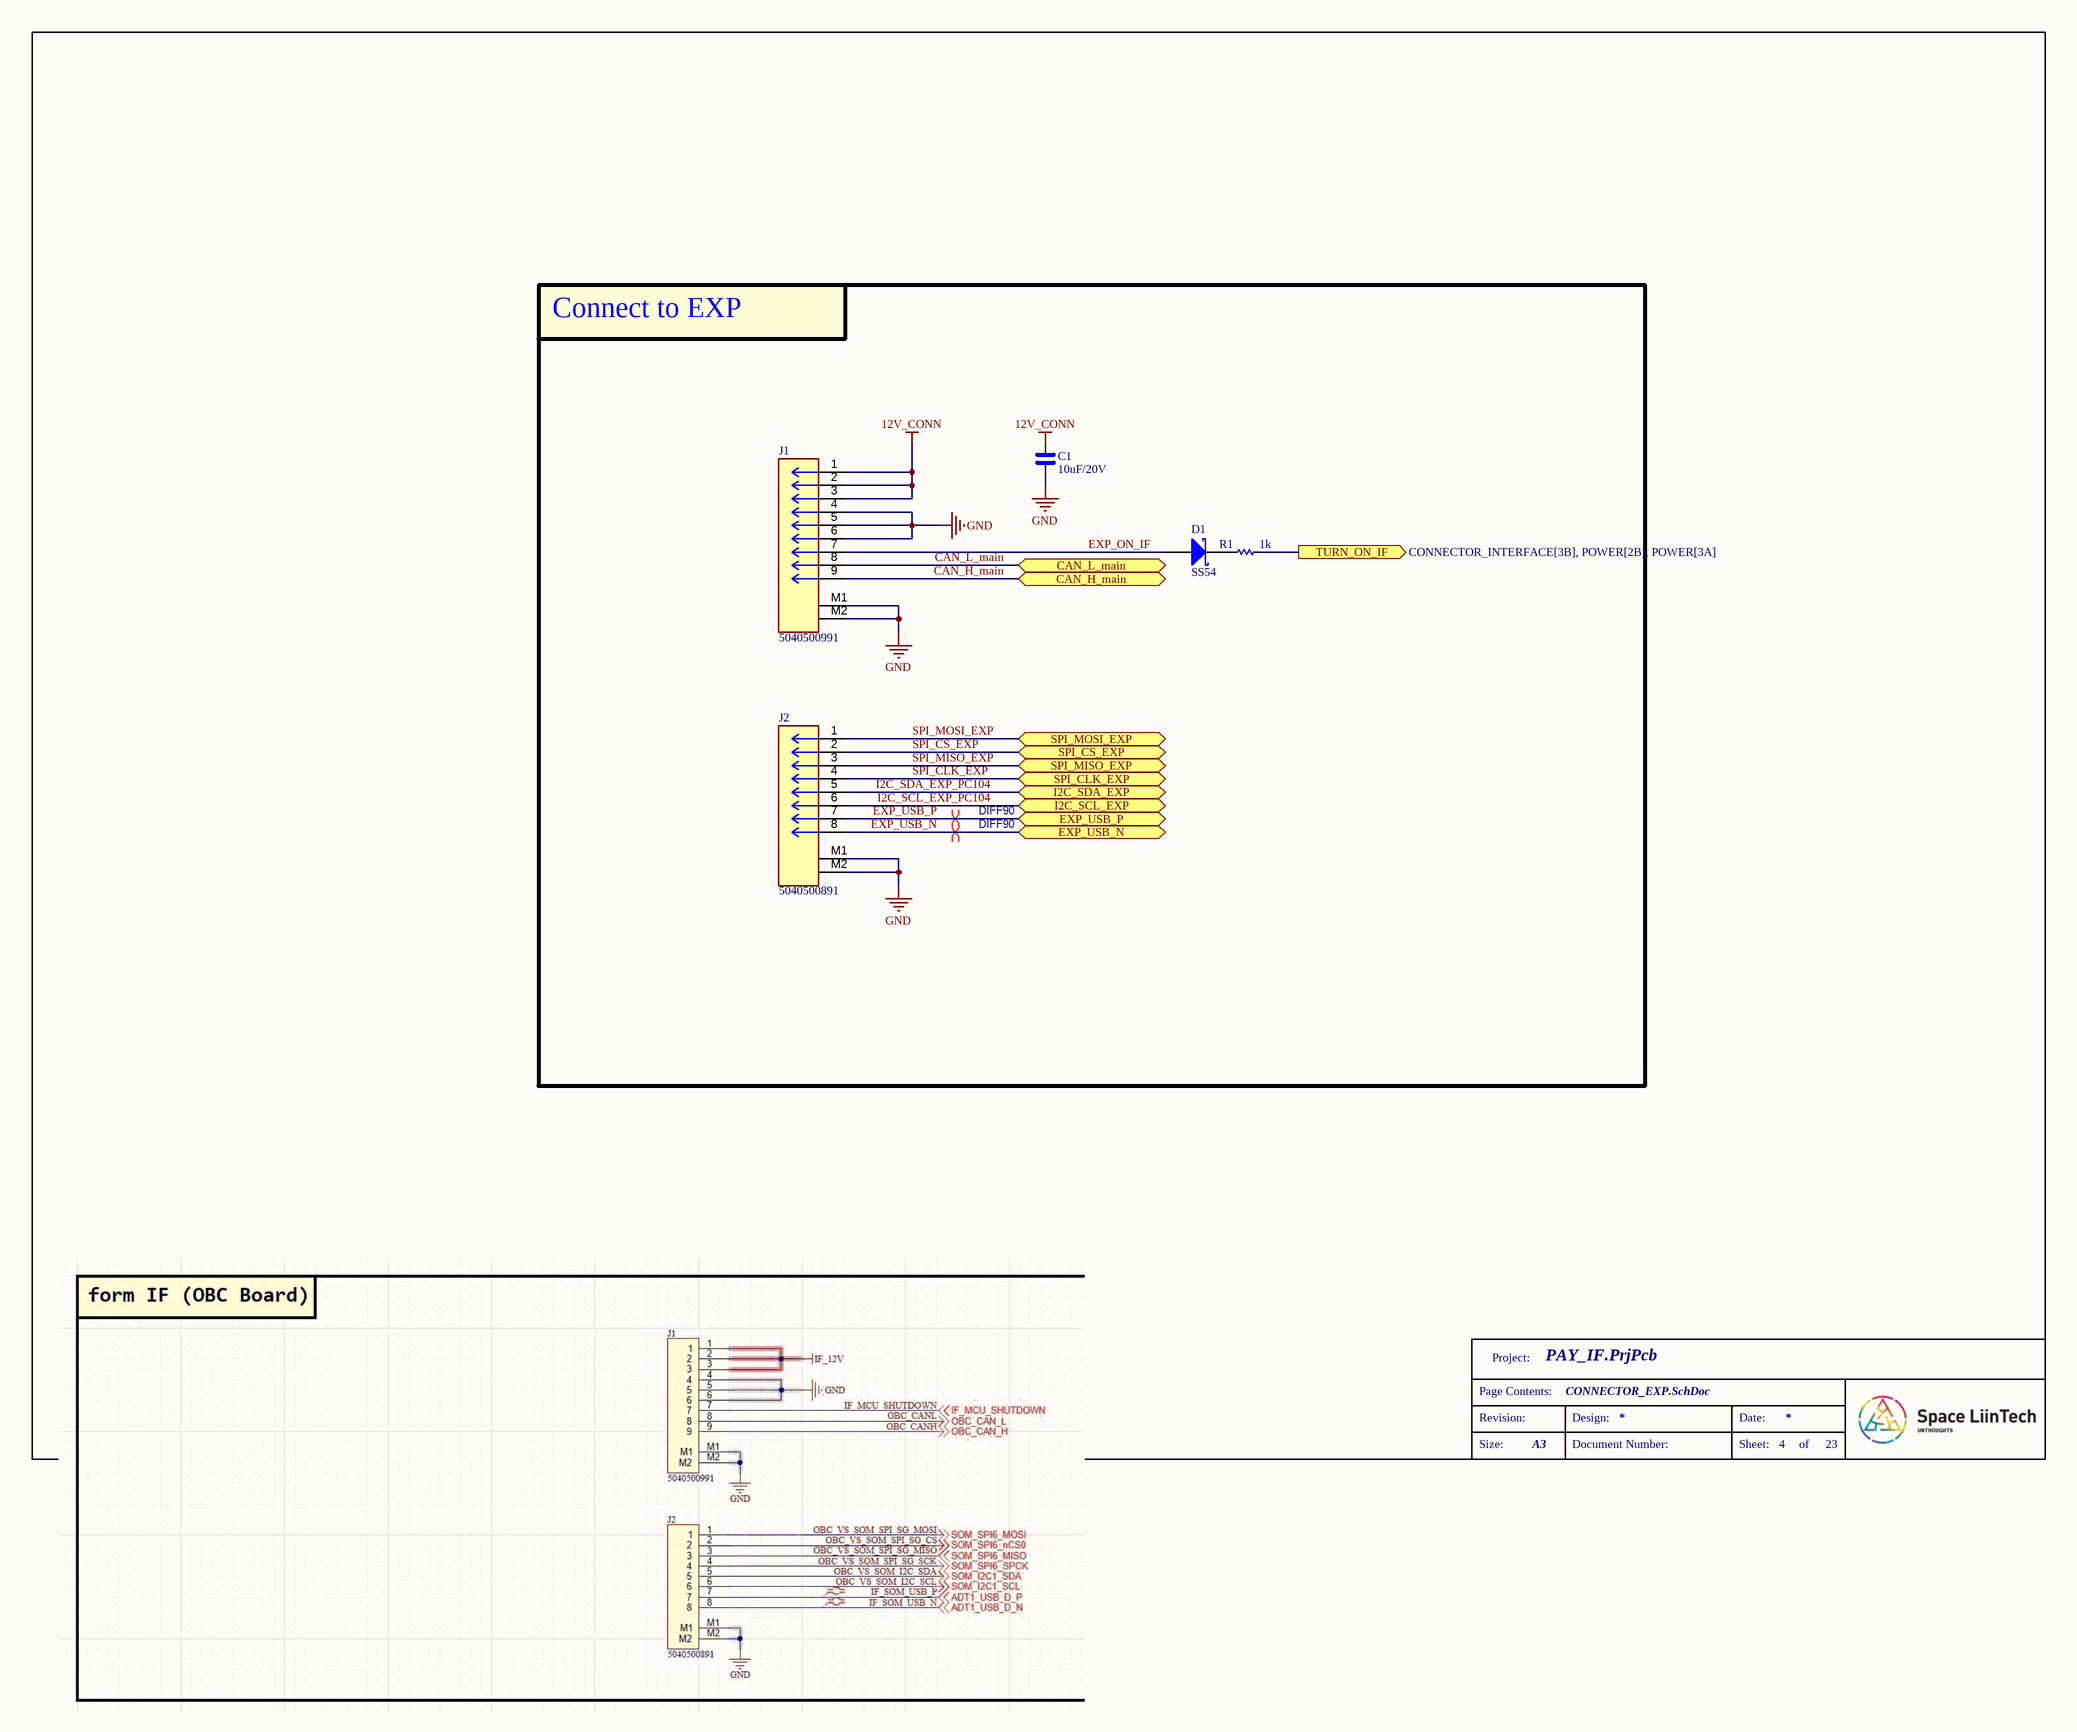
[diagram p3: CONNECTOR_EXP.SchDoc]

### Parts
C1  10uF/20V  [CAP_C_2012X110]
D1  SS54  [DO-214AC_SMA]
J1  5040500991  [MOLEX_5040500991]
J2  5040500891  [MOLEX_5040500891]
R1  1k  [RES_C_1005x30_L]

### Blocks framed on the sheet
Connect to EXP: C1 D1 J1 J2 R1

### Ports
CAN_H_main (bidir, see CAN_PHY[7A], CONNECTOR_INTERFACE[4A], CONNECTOR_INTERFACE[5C]), CAN_L_main (bidir, see CAN_PHY[7B], CONNECTOR_INTERFACE[4A], CONNECTOR_INTERFACE[7C]), EXP_USB_N (bidir, see CONNECTOR_INTERFACE[1C], SAMA7D65_MPU[4B]), EXP_USB_P (bidir, see CONNECTOR_INTERFACE[1C], SAMA7D65_MPU[4B]), I2C_SCL_EXP (bidir, see CONNECTOR_INTERFACE[1D], CONNECTOR_INTERFACE[6B], SAMA7D65_PIO[7A]), I2C_SDA_EXP (bidir, see CONNECTOR_INTERFACE[1C], CONNECTOR_INTERFACE[6B], SAMA7D65_PIO[7A]), SPI_CLK_EXP (bidir, see CONNECTOR_INTERFACE[3D], CONNECTOR_INTERFACE[4A]), SPI_CS_EXP (bidir, see CONNECTOR_INTERFACE[3C], CONNECTOR_INTERFACE[4A]), SPI_MISO_EXP (bidir, see CONNECTOR_INTERFACE[3D], CONNECTOR_INTERFACE[4A]), SPI_MOSI_EXP (bidir, see CONNECTOR_INTERFACE[3D], CONNECTOR_INTERFACE[4A]), TURN_ON_IF (out, see CONNECTOR_INTERFACE[3B], POWER[2B], POWER[3A])

### Nets
12V_CONN: C1.2 J1.1 J1.2 J1.3
GND: C1.1 J1.4 J1.5 J1.6 J1.M1 J1.M2 J2.M1 J2.M2
CAN_H_main: J1.9 ; port CAN_H_main
CAN_L_main: J1.8 ; port CAN_L_main
EXP_ON_IF: D1.1(A) J1.7
EXP_USB_N: J2.8 ; port EXP_USB_N
EXP_USB_P: J2.7 ; port EXP_USB_P
I2C_SCL_EXP_PC104: J2.6 ; port I2C_SCL_EXP  [project net FLEXCOM1_I2C_SCL]
I2C_SDA_EXP_PC104: J2.5 ; port I2C_SDA_EXP  [project net FLEXCOM1_I2C_SDA]
SPI_CLK_EXP: J2.4 ; port SPI_CLK_EXP
SPI_CS_EXP: J2.2 ; port SPI_CS_EXP
SPI_MISO_EXP: J2.3 ; port SPI_MISO_EXP
SPI_MOSI_EXP: J2.1 ; port SPI_MOSI_EXP
NetD1_2: D1.2(K) R1.1
NetD4_2: R1.2 ; port TURN_ON_IF

### Layout directives
differential pair; differential pair class DIFF90; net class DIFF90; rule Matched Net Lengths [Tolerance = 4mil]: EXP_USB_N, EXP_USB_P

### Notes on the sheet
- Project:
- Page Contents:
- Revision:
- Design:
- Date:
- Size:
- A3
- Document Number:
- Sheet:
- of

### Library data of the parts
C1 = _CAP_C_High_2: CAP CHIP High Value
D1 = SS54: as D3 on sheet Power; MFR: *
J1 = 5040500991: Connector Header Surface Mount, Right Angle 9 position 0.059" (1.50mm)
J2 = 5040500891: Connector Header Surface Mount, Right Angle 8 position 0.059" (1.50mm)`
R1 = _RES_B_2: RES

## Sheet CONNECTOR_INTERFACE.SchDoc
size 420 x 297 mm; SheetNumber: 5; SheetTotal: 23
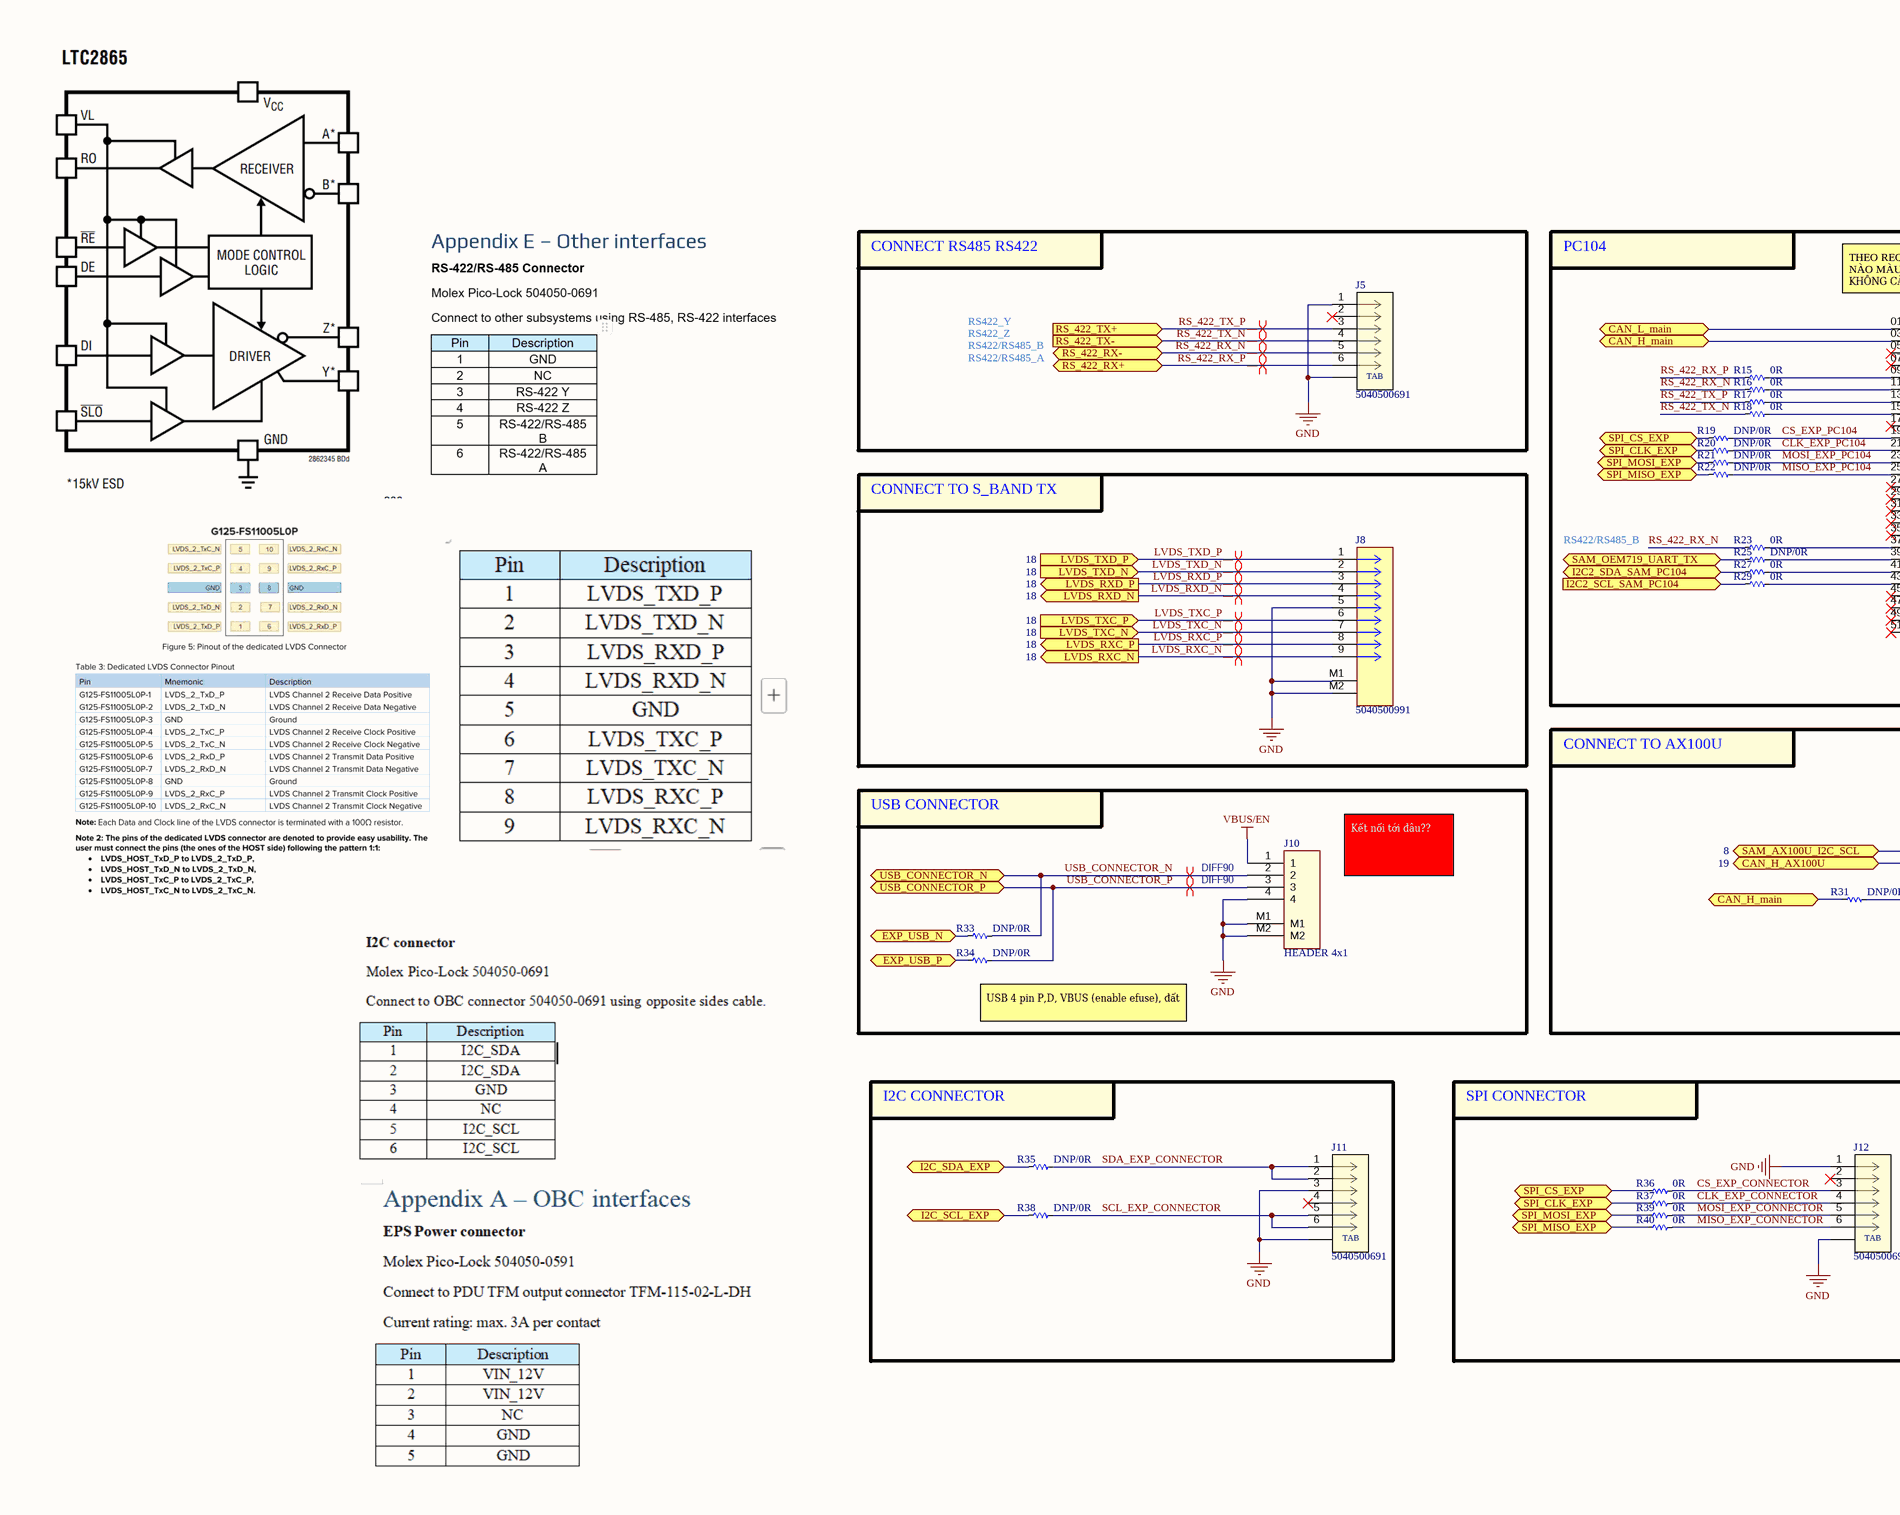
[diagram p4: CONNECTOR_INTERFACE.SchDoc, left]
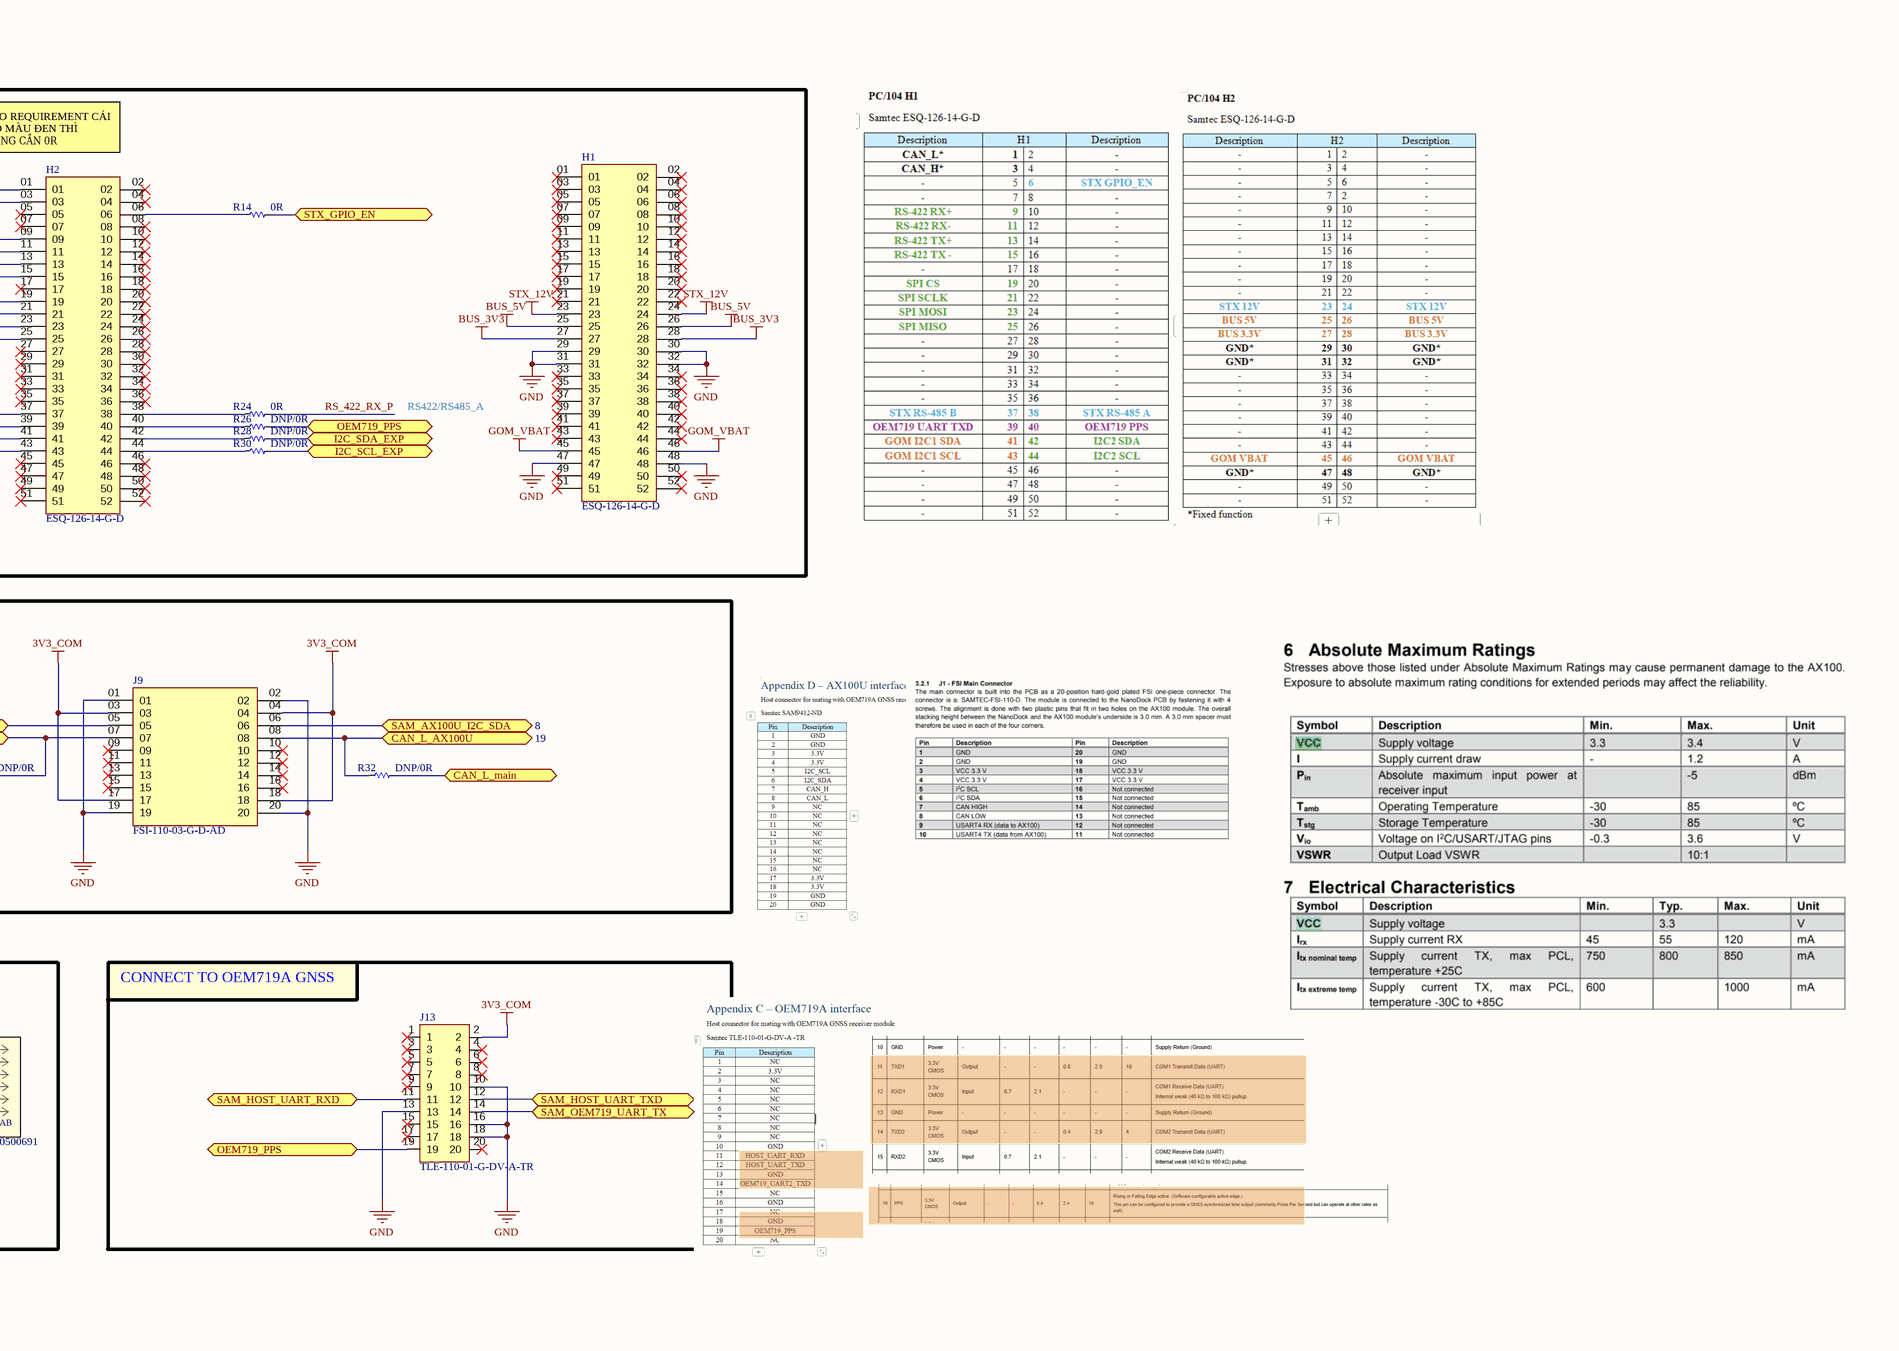
[diagram p5: CONNECTOR_INTERFACE.SchDoc, right]

### Parts
(Parts that share a designator on the sheet are numbered #1, #2 ... from top to bottom, then left to right.)
H1#1  ESQ-126-14-G-D  [SAMTEC_ESQ-126-14-G-D]
H2#1  ESQ-126-14-G-D  [SAMTEC_ESQ-126-14-G-D]
J5  5040500691  [5040500691]
J8  5040500991  [5040500991]
J9  FSI-110-03-G-D-AD  [SAMTEC_FSI-110-03-X-D-AD-TR]
J10  HEADER 4x1  [MOLEX_5040500491]
J11#1  5040500691  [5040500691]
J12  5040500691  [5040500691]
J13  TLE-110-01-G-DV-A-TR  [SAMTEC-TLE-110-01-X-DV-A]
R14#2  0R  [RES_C_1005x30_L]
R15#2  0R  [RES_C_1005x30_L]
R16#1  0R  [RES_C_1005x30_L]
R17  0R  [RES_C_1005x30_L]
R18#1  0R  [RES_C_1005x30_L]
R19  DNP/0R  [RES_C_1005x30_L]
R20  DNP/0R  [RES_C_1005x30_L]
R21  DNP/0R  [RES_C_1005x30_L]
R22  DNP/0R  [RES_C_1005x30_L]
R23  0R  [RES_C_1005x30_L]
R24  0R  [RES_C_1005x30_L]
R25  DNP/0R  [RES_C_1005x30_L]
R26  DNP/0R  [RES_C_1005x30_L]
R27  0R  [RES_C_1005x30_L]
R28  DNP/0R  [RES_C_1005x30_L]
R29  0R  [RES_C_1005x30_L]
R30  DNP/0R  [RES_C_1005x30_L]
R31  DNP/0R  [RES_C_1005x30_L]
R32  DNP/0R  [RES_C_1005x30_L]
R33  DNP/0R  [RES_C_1005x30_L]
R34  DNP/0R  [RES_C_1005x30_L]
R35  DNP/0R  [RES_C_1005x30_L]
R36  0R  [RES_C_1005x30_L]
R37  0R  [RES_C_1005x30_L]
R38  DNP/0R  [RES_C_1005x30_L]
R39  0R  [RES_C_1005x30_L]
R40  0R  [RES_C_1005x30_L]

### Blocks framed on the sheet
CONNECT RS485 RS422: J5
PC104: H1#1 H2#1 R14#2 R15#2 R16#1 R17 R18#1 R19-R30
CONNECT TO S_BAND TX: J8
CONNECT TO AX100U: J9 R31 R32
USB CONNECTOR: J10 R33 R34
I2C CONNECTOR: J11#1 R35 R38
SPI CONNECTOR: J12 R36 R37 R39 R40
CONNECT TO OEM719A GNSS: J13

### Ports
CAN_H_AX100U (bidir, see 19), CAN_H_main (bidir, see 4, 5, 19), CAN_L_AX100U (bidir, see 19), CAN_L_main (bidir, see 4, 5, 19), EXP_USB_N (bidir, see 4, 7), EXP_USB_P (bidir, see 4, 7), I2C2_SCL_SAM_PC104 (in, see 8), I2C2_SDA_SAM_PC104 (bidir, see 8), I2C_SCL_EXP (bidir, see 4, 5, 8), I2C_SDA_EXP (bidir, see 4, 5, 8), LVDS_RXC_N (out, see 18), LVDS_RXC_P (out, see 18), LVDS_RXD_N (out, see 18), LVDS_RXD_P (out, see 18), LVDS_TXC_N (in, see 18), LVDS_TXC_P (in, see 18), LVDS_TXD_N (in, see 18), LVDS_TXD_P (in, see 18), OEM719_PPS (bidir, see 5, 8), RS_422_RX+ (bidir, see 21), RS_422_RX- (bidir, see 21), RS_422_TX+ (in, see 21), RS_422_TX- (in, see 21), SAM_AX100U_I2C_SCL (bidir, see 8), SAM_AX100U_I2C_SDA (bidir, see 8), SAM_HOST_UART_RXD (bidir, see 8), SAM_HOST_UART_TXD (bidir, see 8), SAM_OEM719_UART_TX (bidir, see 5, 8), SPI_CLK_EXP (bidir, see 4, 5), SPI_CS_EXP (bidir, see 4, 5), SPI_MISO_EXP (bidir, see 4, 5), SPI_MOSI_EXP (bidir, see 4, 5), STX_GPIO_EN (bidir, see 8), USB_CONNECTOR_N (bidir, see 13), USB_CONNECTOR_P (bidir, see 13)

### Nets
3V3_COM: J9.03 J9.04 J9.17 J9.18 J13.2
BUS_3V3: H1#1.27 H1#1.28
BUS_5V: H1#1.25 H1#1.26
GND: H1#1.29 H1#1.30 H1#1.31 H1#1.32 H1#1.47 H1#1.48 J5.1 J5.7 J8.5 J8.M1 J8.M2 J9.01 J9.02 J9.19 J9.20 J10.4 J10.M1 J10.M2 J11#1.3 J11#1.7 J12.1 J12.7 J13.10 J13.13 J13.16 J13.18
GOM_VBAT: H1#1.45 H1#1.46
STX_12V: H1#1.23 H1#1.24
VBUS/EN: J10.1
CAN_H_main: H2#1.03 R31.1 ; port CAN_H_main
CAN_L_main: H2#1.01 R32.2 ; port CAN_L_main
CLK_EXP_CONNECTOR: J12.4 R37.2
CLK_EXP_PC104: H2#1.21 R20.2
CS_EXP_CONNECTOR: J12.3 R36.2
CS_EXP_PC104: H2#1.19 R19.2
EXP_USB_N: R33.1 ; port EXP_USB_N
EXP_USB_P: R34.1 ; port EXP_USB_P
FLEXCOM1_I2C_SCL: R30.2 R38.1 ; port I2C_SCL_EXP
FLEXCOM1_I2C_SDA: R28.2 R35.1 ; port I2C_SDA_EXP
FLEXCOM4_I2C_SCL: J9.05 ; port SAM_AX100U_I2C_SCL
FLEXCOM4_I2C_SDA: J9.06 ; port SAM_AX100U_I2C_SDA
FLEXCOM5_I2C_SCL: R29.1 ; port I2C2_SCL_SAM_PC104
FLEXCOM5_I2C_SDA: R27.1 ; port I2C2_SDA_SAM_PC104
FLEXCOM6_UART_TX: J13.14 R25.1 ; port SAM_OEM719_UART_TX
FLEXCOM7_UART_RX: J13.11 ; port SAM_HOST_UART_RXD
FLEXCOM7_UART_TX: J13.12 ; port SAM_HOST_UART_TXD
LVDS_RXC_N: J8.9 ; port LVDS_RXC_N
LVDS_RXC_P: J8.8 ; port LVDS_RXC_P
LVDS_RXD_N: J8.4 ; port LVDS_RXD_N
LVDS_RXD_P: J8.3 ; port LVDS_RXD_P
LVDS_TXC_N: J8.7 ; port LVDS_TXC_N
LVDS_TXC_P: J8.6 ; port LVDS_TXC_P
LVDS_TXD_N: J8.2 ; port LVDS_TXD_N
LVDS_TXD_P: J8.1 ; port LVDS_TXD_P
MISO_EXP_CONNECTOR: J12.6 R40.2
MISO_EXP_PC104: H2#1.25 R22.2
MOSI_EXP_CONNECTOR: J12.5 R39.2
MOSI_EXP_PC104: H2#1.23 R21.2
RS_422_RX_N: J5.5 R16#1.1 R23.1 ; port RS_422_RX-
RS_422_RX_P: J5.6 R15#2.1 R24.2 ; port RS_422_RX+
RS_422_TX_N: J5.4 R18#1.1 ; port RS_422_TX-
RS_422_TX_P: J5.3 R17.1 ; port RS_422_TX+
SCL_EXP_CONNECTOR: J11#1.5 J11#1.6 R38.2
SDA_EXP_CONNECTOR: J11#1.1 J11#1.2 R35.2
SPI_CLK_EXP: R20.1 R37.1 ; port SPI_CLK_EXP
SPI_CS_EXP: R19.1 R36.1 ; port SPI_CS_EXP
SPI_MISO_EXP: R22.1 R40.1 ; port SPI_MISO_EXP
SPI_MOSI_EXP: R21.1 R39.1 ; port SPI_MOSI_EXP
STX_GPIO: R14#2.2 ; port STX_GPIO_EN
USB_CONNECTOR_N: J10.2 R33.2 ; port USB_CONNECTOR_N
USB_CONNECTOR_P: J10.3 R34.2 ; port USB_CONNECTOR_P
NetH2#1_06: H2#1.06 R14#2.1
NetH2#1_09: H2#1.09 R15#2.2
NetH2#1_11: H2#1.11 R16#1.2
NetH2#1_13: H2#1.13 R17.2
NetH2#1_15: H2#1.15 R18#1.2
NetH2#1_37: H2#1.37 R23.2
NetH2#1_38: H2#1.38 R24.1
NetH2#1_39: H2#1.39 R25.2
NetH2#1_40: H2#1.40 R26.1
NetH2#1_41: H2#1.41 R27.2
NetH2#1_42: H2#1.42 R28.1
NetH2#1_43: H2#1.43 R29.2
NetH2#1_44: H2#1.44 R30.1
NetJ9_07: J9.07 R31.2 ; port CAN_H_AX100U
NetJ9_08: J9.08 R32.1 ; port CAN_L_AX100U
NetJ13_19: J13.19 R26.2 ; port OEM719_PPS

Not connected (* = marked no-connect by the designer): H1#1 01* 02* 03* 04* 05* 06* 07* 08* 09* 10* 11* 12* 13* 14* 15* 16* 17* 18* 19* 20* 21* 22* 33* 34* 35* 36* 37* 38* 39* 40* 41* 42* 43* 44* 49* 50* 51* 52*; H2#1 02* 04* 05* 07* 08* 10* 12* 14* 16* 17* 18* 20* 22* 24* 26* 27* 28* 29* 30* 31* 32* 33* 34* 35* 36* 45* 46* 47* 48* 49* 50* 51* 52*; J5 2*; J9 09* 10* 11* 12* 13* 14* 15* 16*; J11#1 4*; J12 2*; J13 1* 3* 4* 5* 6* 7* 8* 9* 15* 17* 20*

### Layout directives
differential pair: LVDS_RXC_N, LVDS_RXC_P, LVDS_RXD_N, LVDS_RXD_P, LVDS_TXC_N, LVDS_TXC_P, LVDS_TXD_N, LVDS_TXD_P, RS_422_RX_N, RS_422_RX_P, RS_422_TX_N, RS_422_TX_P
differential pair; differential pair class DIFF90; net class DIFF90; rule Matched Net Lengths [Tolerance = 4mil]: USB_CONNECTOR_N, USB_CONNECTOR_P

### Notes on the sheet
- RS422_Z
- RS422_Y
- (near H2#1) THEO REQUIREMENT CÁI NÀO MÀU ĐEN THÌ KHÔNG CẦN 0R
- RS422/RS485_A
- RS422/RS485_B
- Kết nối tới đâu??
- (near R34) USB 4 pin P,D, VBUS (enable efuse), đất
- Project:
- BEE-1012
- Sub-system:
- SATELLITE_EXP_CONTROLLER
- Design by:
- SANG HUYNH
- BAO BUI
- Sheet title:
- Sheet
- A3
- of
- Checked by:
- Approved by:
- VU PHAM
- Revision:
- Document No:
- Size:
- Date:
- (in symbol 5040500691) TAB

### Library data of the parts
H1#1 H2#1 = ESQ-126-14-G-D: CONN SOCKET 52POS 0.1 GOLD PCB; MF: Samtec; MP: ESQ-126-14-G-D; Price: None; Package: None; Value: *; Availability: Unavailable
J5 J11#1 J12 = 5040500691: 1.50mm Pitch, Pico-Lock PCB Header, Single Row, Right-Angle, Surface Mount, Gold (Au) Plating, Positive Lock, 6 Circuits, Tape and Reel; Manufacturer_Name: Molex Connector Corporation; Copyright: Copyright (C) 2025 Ultra Librarian. All rights reserved.; Manufacturer_Part_Number: 5040500691; Datasheet: https://www.molex.com/en-us/products/part-detail-pdf/5040500691?display=pdf; RefDes: RefDes; Type: Type
J8 = 5040500991: as J1 on sheet CONNECTOR_EXP
J9 = FSI-110-03-X-D-AD-TR: CONN STACKING 20POS SMD GOLD; Price: None; Value: *; Package: None; MP: FSI-110-03-X-D-AD-TR; Availability: Unavailable
J10 = Header 4x1_2M
J13 = SAMTEC-TLE-110-01-X-DV-A: CONN RCPT 20POS 0.079 GOLD SMD; Availability: Unavailable; MP: SAMTEC-TLE-110-01-X-DV-A; Price: None; Value: *; Package: None
R14#2 R15#2 R16#1 R17 R18#1 R19-R40 = _RES_B_2: RES

## Sheet SAMA7D65_PMIC.SchDoc
size A3; SheetNumber: 6; SheetTotal: 23
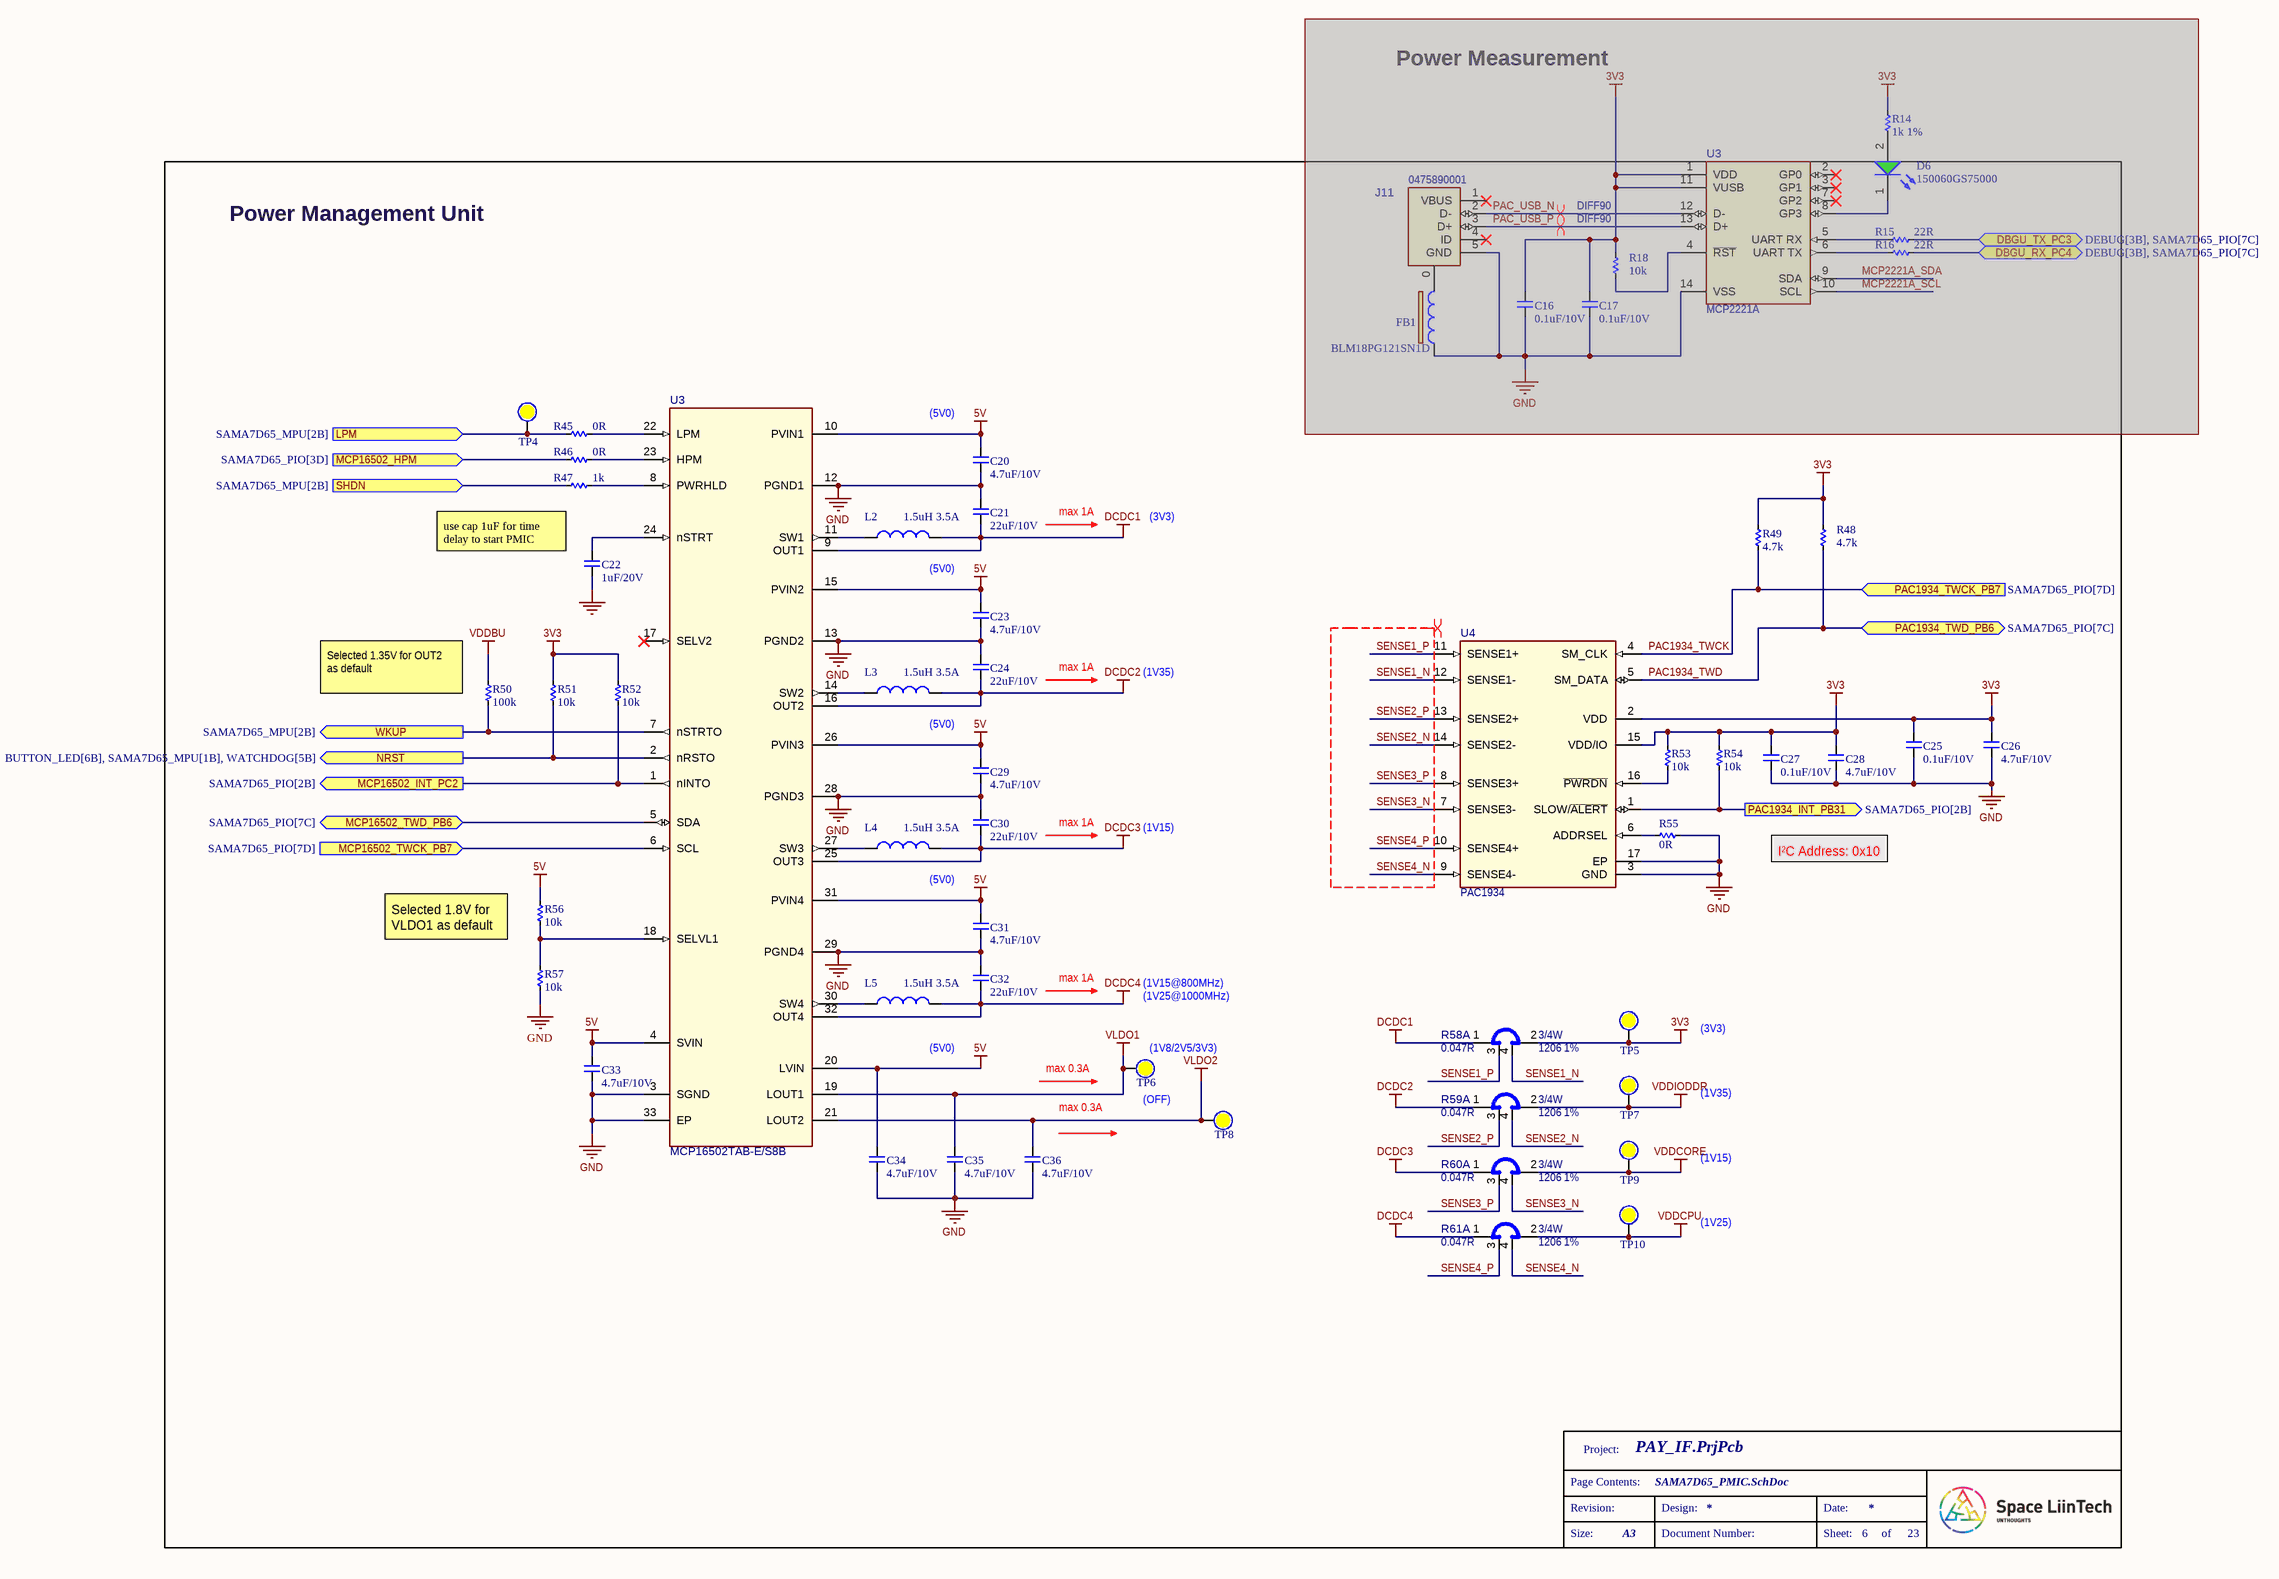
[diagram p6: SAMA7D65_PMIC.SchDoc]

### Parts
(Parts that share a designator on the sheet are numbered #1, #2 ... from top to bottom, then left to right.)
C16#2  0.1uF/10V  [CAP_C_1005X60]  (masked out: inside a compile mask, not in the netlist)
C17#2  0.1uF/10V  [CAP_C_1005X60]  (masked out: inside a compile mask, not in the netlist)
C20  4.7uF/10V  [CAP_C_1005X50_L]
C21  22uF/10V  [CAP_C_1608X80]
C22  1uF/20V  [CAP_C_1005X50_L]
C23  4.7uF/10V  [CAP_C_1005X50_L]
C24  22uF/10V  [CAP_C_1608X80]
C25  0.1uF/10V  [CAP_C_1005X50_L]
C26  4.7uF/10V  [CAP_C_1005X50_L]
C27  0.1uF/10V  [CAP_C_1005X50_L]
C28  4.7uF/10V  [CAP_C_1005X50_L]
C29  4.7uF/10V  [CAP_C_1005X50_L]
C30  22uF/10V  [CAP_C_1608X80]
C31  4.7uF/10V  [CAP_C_1005X50_L]
C32  22uF/10V  [CAP_C_1608X80]
C33  4.7uF/10V  [CAP_C_1005X50_L]
C34  4.7uF/10V  [CAP_C_1005X50_L]
C35  4.7uF/10V  [CAP_C_1005X50_L]
C36  4.7uF/10V  [CAP_C_1005X50_L]
D6#2  150060GS75000  [LED-0603-GREEN]  (masked out: inside a compile mask, not in the netlist)
FB1#1  BLM18PG121SN1D  [IND_BLM18_0603_MUR]  (masked out: inside a compile mask, not in the netlist)
J11#2  value 0475890001  [CON_USB_Micro-AB_SMD_RA_MOLEX_0475890001]  (hidden comment: CON USB2.0 Mini_Micro)  (masked out: inside a compile mask, not in the netlist)
L2  1.5uH 3.5A  [IND_C_1008]
L3  1.5uH 3.5A  [IND_C_1008]
L4  1.5uH 3.5A  [IND_C_1008]
L5  1.5uH 3.5A  [IND_C_1008]
R14#3  1k 1%  [RES_C_1005x30_L]  (masked out: inside a compile mask, not in the netlist)
R15#3  22R  [RES_C_1005x30_L]  (masked out: inside a compile mask, not in the netlist)
R16#2  22R  [RES_C_1005x30_L]  (masked out: inside a compile mask, not in the netlist)
R18#2  10k  [RES_C_1005x30_L]  (masked out: inside a compile mask, not in the netlist)
R45  0R  [RES_C_1005x30_L]
R46  0R  [RES_C_1005x30_L]
R47  1k  [RES_C_1005x30_L]
R48  4.7k  [RES_C_1005x30_L]
R49  4.7k  [RES_C_1005x30_L]
R50  100k  [RES_C_1005x30_L]
R51  10k  [RES_C_1005x30_L]
R52  10k  [RES_C_1005x30_L]
R53  10k  [RES_C_1005x30_L]
R54  10k  [RES_C_1005x30_L]
R55  0R  [RES_C_1005x30_L]
R56  10k  [RES_C_1005x30_L]
R57  10k  [RES_C_1005x30_L]
R58  value 0.047R  Package: 1206  Tolerance: 1%  Power: 3/4W  [RES_C_1206_SHUNT]  (hidden comment: Shunt 4 Pin)  (part A of 2)
R59  value 0.047R  Package: 1206  Tolerance: 1%  Power: 3/4W  [RES_C_1206_SHUNT]  (hidden comment: Shunt 4 Pin)  (part A of 2)
R60  value 0.047R  Package: 1206  Tolerance: 1%  Power: 3/4W  [RES_C_1206_SHUNT]  (hidden comment: Shunt 4 Pin)  (part A of 2)
R61  value 0.047R  Package: 1206  Tolerance: 1%  Power: 3/4W  [RES_C_1206_SHUNT]  (hidden comment: Shunt 4 Pin)  (part A of 2)
TP4  (no value)  [Test point]  (no BOM)
TP5  (no value)  [Test point]  (no BOM)
TP6  (no value)  [Test point]  (no BOM)
TP7  (no value)  [Test point]  (no BOM)
TP8  (no value)  [Test point]  (no BOM)
TP9  (no value)  [Test point]  (no BOM)
TP10  (no value)  [Test point]  (no BOM)
U3#1  value MCP2221A  [SOIC-14]  (hidden comment: MCP2221 SOIC-14_TSSOP-14_PDIP-14)  (masked out: inside a compile mask, not in the netlist)
U3#2  value MCP16502TAB-E/S8B  [QFN-32_5X5_EP3.7X3.7]  (hidden comment: MCP16502 QFN-32)
U4  value PAC1934  [UQFN-16_4X4_EP2.6X2.6]  (hidden comment: Microchip PAC1934 UQFN-16)

### Ports
DBGU_RX_PC4 (bidir, see DEBUG[3B], SAMA7D65_PIO[7C]), DBGU_TX_PC3 (bidir, see DEBUG[3B], SAMA7D65_PIO[7C]), LPM (in, see SAMA7D65_MPU[2B]), MCP16502_HPM (in, see SAMA7D65_PIO[3D]), MCP16502_INT_PC2 (out, see SAMA7D65_PIO[2B]), MCP16502_TWCK_PB7 (in, see SAMA7D65_PIO[7D]), MCP16502_TWD_PB6 (bidir, see SAMA7D65_PIO[7C]), NRST (out, see BUTTON_LED[6B], SAMA7D65_MPU[1B], WATCHDOG[5B]), PAC1934_INT_PB31 (out, see SAMA7D65_PIO[2B]), PAC1934_TWCK_PB7 (in, see SAMA7D65_PIO[7D]), PAC1934_TWD_PB6 (bidir, see SAMA7D65_PIO[7C]), SHDN (in, see SAMA7D65_MPU[2B]), WKUP (out, see SAMA7D65_MPU[2B])

### Nets
3V3: C25.2 C26.2 C27.2 C28.2 R48.1 R49.1 R51.2 R52.2 R53.2 R54.2 R58.2 TP5.0 U4.2(VDD) U4.15(VDD/IO)
5V: C20.2 C23.2 C29.2 C31.2 C33.2 C34.2 R56.2 U3#2.4(SVIN) U3#2.10(PVIN1) U3#2.15(PVIN2) U3#2.20(LVIN) U3#2.26(PVIN3) U3#2.31(PVIN4)
DCDC1: C21.1 L2.2 R58.1 U3#2.9(OUT1)
DCDC2: C24.1 L3.2 R59.1 U3#2.16(OUT2)
DCDC3: C30.1 L4.2 R60.1 U3#2.25(OUT3)
DCDC4: C32.1 L5.2 R61.1 U3#2.32(OUT4)
GND: C20.1 C21.2 C22.1 C23.1 C24.2 C25.1 C26.1 C27.1 C28.1 C29.1 C30.2 C31.1 C32.2 C33.1 C34.1 C35.1 C36.1 R55.2 R57.1 U3#2.3(SGND) U3#2.12(PGND1) U3#2.13(PGND2) U3#2.28(PGND3) U3#2.29(PGND4) U3#2.33(EP) U4.3(GND) U4.17(EP)
VDDBU: R50.2
VDDCORE: R60.2 TP9.0
VDDCPU: R61.2 TP10.0
VDDIODDR: R59.2 TP7.0
VLDO1: C35.2 TP6.0 U3#2.19(LOUT1)
VLDO2: C36.2 TP8.0 U3#2.21(LOUT2)
HPM_MCP16502: R46.1 ; port MCP16502_HPM
LPM: R45.1 TP4.0 ; port LPM
NRST: R51.1 U3#2.2(nRSTO) ; port NRST
PAC1934_TWCK: R49.2 U4.4(SM_CLK) ; port PAC1934_TWCK_PB7
PAC1934_TWD: R48.2 U4.5(SM_DATA) ; port PAC1934_TWD_PB6
SENSE1_N: R58.4 U4.12(SENSE1-)
SENSE1_P: R58.3 U4.11(SENSE1+)
SENSE2_N: R59.4 U4.14(SENSE2-)
SENSE2_P: R59.3 U4.13(SENSE2+)
SENSE3_N: R60.4 U4.7(SENSE3-)
SENSE3_P: R60.3 U4.8(SENSE3+)
SENSE4_N: R61.4 U4.9(SENSE4-)
SENSE4_P: R61.3 U4.10(SENSE4+)
SHDN: R47.1 ; port SHDN
WKUP: R50.1 U3#2.7(nSTRTO) ; port WKUP
NetC22_2: C22.2 U3#2.24(nSTRT)
NetL2_1: L2.1 U3#2.11(SW1)
NetL3_1: L3.1 U3#2.14(SW2)
NetL4_1: L4.1 U3#2.27(SW3)
NetL5_1: L5.1 U3#2.30(SW4)
NetR45_2: R45.2 U3#2.22(LPM)
NetR46_2: R46.2 U3#2.23(HPM)
NetR47_2: R47.2 U3#2.8(PWRHLD)
NetR52_1: R52.1 U3#2.1(nINTO) ; port MCP16502_INT_PC2
NetR53_1: R53.1 U4.16(~{PWRDN})
NetR54_1: R54.1 U4.1(SLOW/~{ALERT}) ; port PAC1934_INT_PB31
NetR55_1: R55.1 U4.6(ADDRSEL)
NetR56_1: R56.1 R57.2 U3#2.18(SELVL1)
NetR158_2: U3#2.5(SDA) ; port MCP16502_TWD_PB6
NetR162_2: U3#2.6(SCL) ; port MCP16502_TWCK_PB7

Not connected (* = marked no-connect by the designer): U3#2 17(SELV2)*

### Layout directives
differential pair: SENSE1_N, SENSE1_P, SENSE2_N, SENSE2_P, SENSE3_N, SENSE3_P, SENSE4_N, SENSE4_P
differential pair; differential pair class DIFF90; net class DIFF90; rule Matched Net Lengths [Tolerance = 4mil]: (no net found under the mark)

### Notes on the sheet
- Power Measurement
- Power Management Unit
- (near C20) (5V0)
- use cap 1uF for time delay to start PMIC
- max 1A
- (3V3)
- (near L2) (5V0)
- (near R50) Selected 1.35V for OUT2 as default
- (1V35)
- (near L3) (5V0)
- (near L4) (5V0)
- (1V15)
- I²C Address: 0x10
- Selected 1.8V for VLDO1 as default
- (1V15@800MHz)
- (1V25@1000MHz)
- (near L5) (5V0)
- (near TP6) max 0.3A
- (near TP6) (1V8/2V5/3V3)
- max 0.3A
- (near TP6) (OFF)
- (1V25)
- Project:
- Page Contents:
- Revision:
- Design:
- Date:
- Size:
- A3
- Document Number:
- Sheet:
- of

### Library data of the parts
C16#2 C17#2 C20-C36 = _CAP_C_2: CAP CHIP
D6#2 = LED_GREEN: LED GREEN CLEAR 0603 SMD
FB1#1 = BLM18PG121SN1D: FERRITE BEAD 120 OHM 0603 1LN; Manufacturer_Name: Murata; Copyright: Copyright (C) 2025 Ultra Librarian. All rights reserved.; Manufacturer_Part_Number: BLM18PG121SN1D
J11#2 = 0475890001: CONN RCPT MICRO USB AB 5P SMD RA; Manufacturer 1: Molex, LLC; MCHP-ID: CON1753; Description_: CON USB2.0 MICRO-AB FEMALE SMD R/A; Dev Tools Status: Production; Owner: Dragos Danaila; Voltage: 30VAC; Current: 1A, 1.8A; Custom Parameters: 10000 mating cycles; Populated: YES; Revision: 1; Symbol: CON USB2.0 Mini_Micro; Status: MCL Design; ComponentLink1URL: https://chn-vm-apps.microchip.com/mchprepo/parts/Datasheets/475890001_sd.pdf; ComponentLink1Description: SVN Datasheet; ComponentLink2URL: C:\ALTIUM_WORK\00001_MCHP-CDB\Datasheets\475890001_sd.pdf; ComponentLink2Description: Local Datasheet; ComponentLink3URL: C:\ALTIUM_WORK\00001_MCHP-CDB\Library\LibraryRefs\CON USB2.0 Mini_Micro.SchLib; ComponentLink3Description: Open Symbol; ComponentLink4URL: C:\ALTIUM_WORK\00001_MCHP-CDB\Library\Footprints\CON_USB_Micro-AB_SMD_RA_MOLEX_0475890001.PcbLib; ComponentLink4Description: Open Footprint; ComponentLink5Description: Open Footprint 2; ComponentLink6Description: Open Footprint 3; ComponentLink7Description: Open Footprint 4; Type: USB; Category: Connector; Manufacturer Part Number 1: 0475890001; Supplier 1: Digi-Key; Supplier Part Number 1: WM17143CT-ND; Quantity Override: 1; Operating Temperature: -35C to +85C; Assembly Type: SMD
L2-L5 = DFE252012P-1R5M=P2: Fixed Inductor 1.5uH 3.5A R060 SMD; Package: None; Price: None; Value: *; MP: DFE252012P-1R5M=P2; Availability: Unavailable
R14#3 R15#3 R16#2 R18#2 R45-R57 = _RES_B_2: RES
R58-R61 = SHUNT: Shunt Resistor, RES 0.047 OHM 1% 3/4W 1206; Manufacturer 1: SUSUMU; Manufacturer Part Number 1: KRL1632E-M-R047-F-T5; MCHP-ID: RSMT1405; Description_: RES SHUNT MF 0.047R 1% 3/4W SMD 1206; Dev Tools Status: Design; Current: 4A; Owner: Ciprian Abramov; Populated: YES; Temperature Coefficient: ±50ppm/C; Restricted Sourcing: No; Revision: 1; Symbol: Shunt 4 Pin; Status: MCL Design; ComponentLink1URL: https://chn-vm-apps.microchip.com/mchprepo/parts/Datasheets/n_catalog_partition09_en.pdf; ComponentLink1Description: SVN Datasheet; ComponentLink2URL: C:\ALTIUM_WORK\00001_MCHP-CDB\Datasheets\n_catalog_partition09_en.pdf; ComponentLink2Description: Local Datasheet; ComponentLink3URL: C:\ALTIUM_WORK\00001_MCHP-CDB\Library\LibraryRefs\Shunt 4 Pin.SchLib; ComponentLink3Description: Open Symbol; ComponentLink4URL: C:\ALTIUM_WORK\00001_MCHP-CDB\Library\Footprints\RES_C_1206_SHUNT.PcbLib; ComponentLink4Description: Open Footprint; ComponentLink5Description: Open Footprint 2; ComponentLink6Description: Open Footprint 3; ComponentLink7Description: Open Footprint 4; Operating Temperature: -55C to 155C; Category: Resistor; Type: Shunt; Composition: MF; Supplier 1: Digi-Key; Supplier Part Number 1: 408-1578-2-ND; Quantity Override: 1
TP4-TP10 = Test Point: Solder: NF
U3#1 = MCP2221A-I/SL: IC USB TO I2C/UART 14SOIC; Manufacturer 1: Microchip Technology; MCHP-ID: MIC9078; Description_: MCHP INTERFACE USB I2C UART MCP2221A-I/SL SOIC-14; Dev Tools Status: Design; Owner: Octavian Stroe; Populated: YES; Symbol: MCP2221 SOIC-14_TSSOP-14_PDIP-14; Type: USB; Status: MCL Design; Revision: A; Category: MCHP-Interface; ComponentLink1URL: https://chn-vm-apps.microchip.com/mchprepo/parts/Datasheets/20005292B.pdf; ComponentLink1Description: SVN Datasheet; ComponentLink2URL: C:\ALTIUM_WORK\00001_MCHP-CDB\Datasheets\20005292B.pdf; ComponentLink2Description: Local Datasheet; ComponentLink3URL: C:\ALTIUM_WORK\00001_MCHP-CDB\Library\LibraryRefs\MCP2221 SOIC-14_TSSOP-14_PDIP-14.SchLib; ComponentLink3Description: Open Symbol; ComponentLink4URL: C:\ALTIUM_WORK\00001_MCHP-CDB\Library\Footprints\SOIC-14.PcbLib; ComponentLink4Description: Open Footprint; ComponentLink5Description: Open Footprint 2; ComponentLink6Description: Open Footprint 3; ComponentLink7Description: Open Footprint 4; Manufacturer Part Number 1: MCP2221A-I/SL; Manufacturer 2: Microchip Technology; Manufacturer Part Number 2: MCP2221A-I/SL; Supplier 1: Digi-Key; Supplier Part Number 1: MCP2221A-I/SL-ND; Supplier 2: Mouser; Supplier Part Number 2: 579-MCP2221A-I/SL; Operating Temperature: -40C to +85C; Quantity Override: 1
U3#2 = MIC8878: Manufacturer 1: Microchip Technology; Populated: YES; Description_: MCHP ANALOG PMIC SWITCHER Buck ADJ MCP16502TAB-E/S8B QFN-32 for SAMA7G5 MPU with LPDDR/DDR2/DDR3; Dev Tools Status: Design; Owner: Dragos Danaila; MCHP-ID: MIC8878; Symbol: MCP16502 QFN-32; Type: Switcher; Status: MCL Design; Revision: 1; Category: MCHP-Analog; ComponentLink1Description: SVN Datasheet; ComponentLink2Description: Local Datasheet; ComponentLink3URL: C:\ALTIUM_WORK\00001_MCHP-CDB\Library\LibraryRefs\MCP16502 QFN-32.SchLib; ComponentLink3Description: Open Symbol; ComponentLink4URL: C:\ALTIUM_WORK\00001_MCHP-CDB\Library\Footprints\QFN-32_5X5_EP3.7X3.7.PcbLib; ComponentLink4Description: Open Footprint; ComponentLink5Description: Open Footprint 2; ComponentLink6Description: Open Footprint 3; ComponentLink7Description: Open Footprint 4; Manufacturer Part Number 1: MCP16502TAB-E/S8B; Supplier 1: Digi-Key; Supplier Part Number 1: 150-MCP16502TAB-E/S8BCT-ND; Quantity Override: 1; ComponentLink2URL: C:\ALTIUM_WORK\00001_MCHP-CDB\Datasheets\MCP16502-High-Performance-PMIC-for-SAMA5DX-SAM9X6-MPUs-Data-Sheet-DS20006275B.pdf
U4 = PAC1934T-I/JQ: IC CURRENT MONITOR 1% 16UQFN; Manufacturer 1: Microchip Technology; MCHP-ID: MIC7010; Description_: MCHP ANALOG POWER CURRENT SENSE MONITOR PAC1934T-I/JQ UQFN-16; Dev Tools Status: Production; Owner: Razvan Cristescu; Populated: YES; Restricted Sourcing: No; Symbol: PAC1934 UQFN-16; Type: Power/Current Sensor; Status: MCL Design; Revision: 2; Category: MCHP-Analog; ComponentLink1Description: SVN Datasheet; ComponentLink2Description: Local Datasheet; ComponentLink3URL: C:\ALTIUM_WORK\00001_MCHP-CDB\Library\LibraryRefs\PAC1934 UQFN-16.SchLib; ComponentLink3Description: Open Symbol; ComponentLink4URL: C:\ALTIUM_WORK\00001_MCHP-CDB\Library\Footprints\UQFN-16_4X4_EP2.6X2.6.PcbLib; ComponentLink4Description: Open Footprint; ComponentLink5Description: Open Footprint 2; ComponentLink6Description: Open Footprint 3; ComponentLink7Description: Open Footprint 4; Manufacturer Part Number 1: PAC1934T-I/JQ; Supplier 1: Microchip Technology; Supplier Part Number 1: PAC1934T-I/JQ; Quantity Override: 1; ComponentLink1URL: https://www.microchip.com/sitesearch/search/Product%20and%20Development%20Tools/PAC1934T-I/JQ; Operating Temperature: -40C to +85C